# Altium project OctopusPB_r0101.PrjPcb
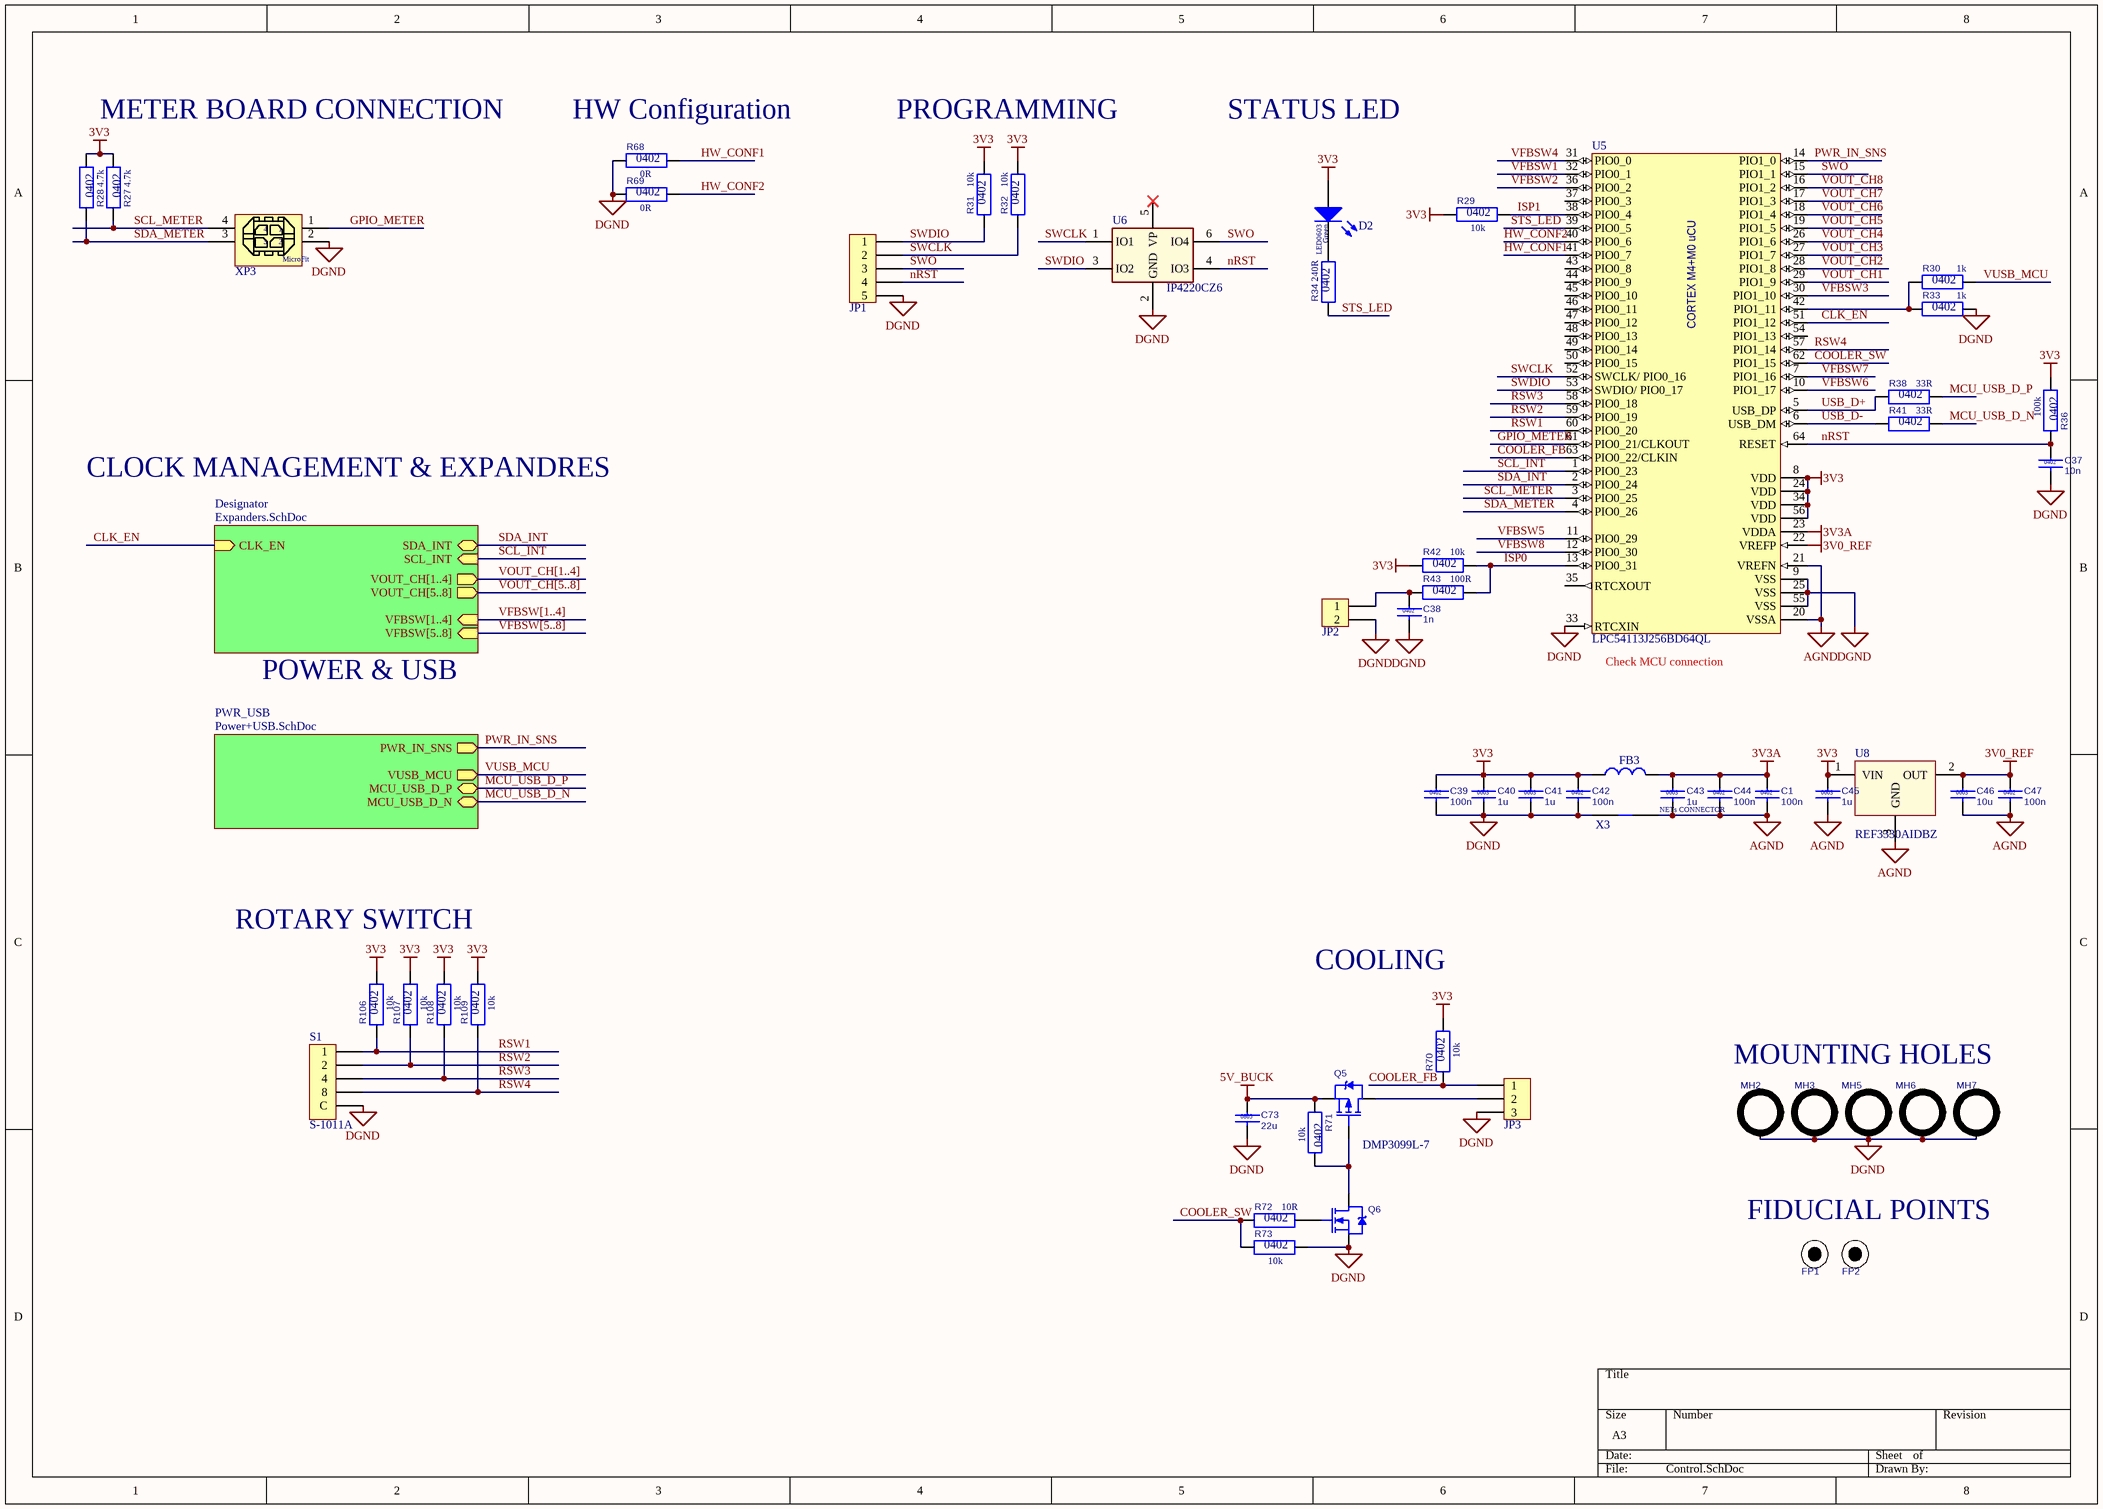
[diagram p0: Control.SchDoc]
3 sheets, 924 parts. Net scope: hierarchical (ports join the sheet entries above them; power ports are global).
Board file: OctopusPB_r0101.PcbDoc
Sheets:
  Control.SchDoc
    Designator = Expanders.SchDoc
      B1 = BuckConverter.SchDoc
      B2 = BuckConverter.SchDoc
      B3 = BuckConverter.SchDoc
      B4 = BuckConverter.SchDoc
      B5 = BuckConverter.SchDoc
      B6 = BuckConverter.SchDoc
      B7 = BuckConverter.SchDoc
      B8 = BuckConverter.SchDoc

## Sheet Control.SchDoc
size A3

### Parts
C1  100n  Case: 0402  [CC0402M]
C37  10n  Case: 0402  [CC0402M]
C38  1n  Case: 0402  [CC0402M]
C39  100n  Case: 0402  [CC0402M]
C40  1u  Case: 0603  [CC0603M]
C41  1u  Case: 0603  [CC0603M]
C42  100n  Case: 0402  [CC0402M]
C43  1u  Case: 0603  [CC0603M]
C44  100n  Case: 0402  [CC0402M]
C45  1u  Case: 0603  [CC0603M]
C46  10u  Case: 0603  [CC0603M]
C47  100n  Case: 0402  [CC0402M]
C73  22u  Case: 0805  [CC0805M]
D2  Color: Green  [LED0603]  (hidden comment: 150060GS75000)
FB3  BLM18HG102SN1D  [FB0603M]  (value not drawn)
FP1  FP  [FP]  (value not drawn)  (no BOM)
FP2  FP  [FP]  (value not drawn)  (no BOM)
JP1  HEADER-2.54-THR-1x5-MV  [HEADER-2.54-THR-1x5-MV]  (value not drawn)
JP2  HEADER-2.54-THR-1x2-MV  [HEADER-2.54-THR-1x2-MV]  (value not drawn)
JP3  HEADER-2.54-THR-1x3-MV  [HEADER-2.54-THR-1x3-MV]  (value not drawn)
MH2  MH-3.5-PLATED  [MH_3.5_PLATED]  (value not drawn)  (no BOM)
MH3  MH-3.5-PLATED  [MH_3.5_PLATED]  (value not drawn)  (no BOM)
MH5  MH-3.5-PLATED  [MH_3.5_PLATED]  (value not drawn)  (no BOM)
MH6  MH-3.5-PLATED  [MH_3.5_PLATED]  (value not drawn)  (no BOM)
MH7  MH-3.5-PLATED  [MH_3.5_PLATED]  (value not drawn)  (no BOM)
Q5  DMP3099L-7  [SOT23-3]
Q6  NX3020NAKW,115  [SOT323]  (value not drawn)
R27  Case: 0402  [RC0402M]  (hidden comment: 4.7k)
R28  Case: 0402  [RC0402M]  (hidden comment: 4.7k)
R29  Case: 0402  [RC0402M]  (hidden comment: 10k)
R30  Case: 0402  [RC0402M]  (hidden comment: 1k)
R31  Case: 0402  [RC0402M]  (hidden comment: 10k)
R32  Case: 0402  [RC0402M]  (hidden comment: 10k)
R33  Case: 0402  [RC0402M]  (hidden comment: 1k)
R34  Case: 0402  [RC0402M]  (hidden comment: 240R)
R36  Case: 0402  [RC0402M]  (hidden comment: 100k)
R38  Case: 0402  [RC0402M]  (hidden comment: 33R)
R41  Case: 0402  [RC0402M]  (hidden comment: 33R)
R42  Case: 0402  [RC0402M]  (hidden comment: 10k)
R43  Case: 0402  [RC0402M]  (hidden comment: 100R)
R68  Case: 0402  [RC0402M]  (hidden comment: 0R)
R69  Case: 0402  [RC0402M]  (hidden comment: 0R)
R70  Case: 0402  [RC0402M]  (hidden comment: 10k)
R71  Case: 0402  [RC0402M]  (hidden comment: 10k)
R72  Case: 0402  [RC0402M]  (hidden comment: 10R)
R73  Case: 0402  [RC0402M]  (hidden comment: 10k)
R106  Case: 0402  [RC0402M]  (hidden comment: 10k)
R107  Case: 0402  [RC0402M]  (hidden comment: 10k)
R108  Case: 0402  [RC0402M]  (hidden comment: 10k)
R109  Case: 0402  [RC0402M]  (hidden comment: 10k)
S1  S-1011A  [S-1011A]
U5  LPC54113J256BD64QL  [LQFP-64]
U6  IP4220CZ6  [TSOP-6]
U8  REF3330AIDBZ  [SOT23-3]
X3  NETs_CONNECTOR  [NETs_CONNECTOR]  (value not drawn)  (no BOM)
XP3  0447690401  [0447690401]  (value not drawn)

### Sub-sheets
Designator = Expanders.SchDoc: SDA_INT (bidir), SCL_INT (in), VOUT_CH[5..8] (out), CLK_EN (in), VFBSW[1..4] (in), VOUT_CH[1..4] (out), VFBSW[5..8] (in)
PWR_USB = Power+USB.SchDoc (file not in this document): PWR_IN_SNS (out), MCU_USB_D_N (bidir), MCU_USB_D_P (bidir), VUSB_MCU (out)

### Nets
3V0_REF: C46.1 C47.1 U5.22(VREFP) U8.2(OUT)
3V3: C39.1 C40.1 C41.1 C42.1 C45.1 D2.2(A) FB3.1 R27.2 R28.2 R29.1 R31.2 R32.2 R36.2 R42.1 R70.2 R106.2 R107.2 R108.2 R109.2 U5.8(VDD) U5.24(VDD) U5.34(VDD) U5.56(VDD) U8.1(VIN)
3V3A: C1.1 C43.1 C44.1 FB3.2 U5.23(VDDA)
5V_BUCK: C73.1 Q5.2(S) R71.1
AGND: C1.2 C43.2 C44.2 C45.2 C46.2 C47.2 U5.20(VSSA) U5.21(VREFN) U8.3(GND) X3.1
DGND: C37.2 C38.2 C39.2 C40.2 C41.2 C42.2 C73.2 JP1.5 JP2.2 JP3.3 MH2.0 MH3.0 MH5.0 MH6.0 MH7.0 Q6.2(S) R33.2 R68.1 R69.1 R73.2 S1.C U5.9(VSS) U5.25(VSS) U5.33(RTCXIN) U5.55(VSS) U6.2(GND) X3.2 XP3.2
CLK_EN: U5.51(PIO1_12) ; sheet Designator/CLK_EN
COOLER_FB: JP3.1 R70.1 U5.63(PIO0_22/CLKIN)
COOLER_SW: R72.1 R73.1 U5.62(PIO1_15)
GPIO_METER: U5.61(PIO0_21/CLKOUT) XP3.1
HW_CONF1: R68.2 U5.41(PIO0_7)
HW_CONF2: R69.2 U5.40(PIO0_6)
ISP0: R42.2 R43.2 U5.13(PIO0_31)
ISP1: R29.2 U5.38(PIO0_4)
MCU_USB_D_N: R41.2 ; sheet PWR_USB/MCU_USB_D_N
MCU_USB_D_P: R38.2 ; sheet PWR_USB/MCU_USB_D_P
nRST: C37.1 JP1.4 R36.1 U5.64(RESET) U6.4(IO3)
PWR_IN_SNS: U5.14(PIO1_0) ; sheet PWR_USB/PWR_IN_SNS
RSW1: R106.1 S1.1 U5.60(PIO0_20)
RSW2: R107.1 S1.2 U5.59(PIO0_19)
RSW3: R108.1 S1.4 U5.58(PIO0_18)
RSW4: R109.1 S1.8 U5.57(PIO1_14)
SCL_INT: U5.1(PIO0_23) ; sheet Designator/SCL_INT
SCL_METER: R27.1 U5.3(PIO0_25) XP3.4
SDA_INT: U5.2(PIO0_24) ; sheet Designator/SDA_INT
SDA_METER: R28.1 U5.4(PIO0_26) XP3.3
STS_LED: R34.1 U5.39(PIO0_5)
SWCLK: JP1.2 R32.1 U5.52(SWCLK/_PIO0_16) U6.1(IO1)
SWDIO: JP1.1 R31.1 U5.53(SWDIO/_PIO0_17) U6.3(IO2)
SWO: JP1.3 U5.15(PIO1_1) U6.6(IO4)
USB_D+: R38.1 U5.5(USB_DP)
USB_D-: R41.1 U5.6(USB_DM)
VFBSW1: U5.32(PIO0_1)
VFBSW2: U5.36(PIO0_2)
VFBSW3: U5.30(PIO1_10)
VFBSW4: U5.31(PIO0_0)
VFBSW5: U5.11(PIO0_29)
VFBSW6: U5.10(PIO1_17)
VFBSW7: U5.7(PIO1_16)
VFBSW8: U5.12(PIO0_30)
VOUT_CH1: U5.29(PIO1_9)
VOUT_CH2: U5.28(PIO1_8)
VOUT_CH3: U5.27(PIO1_7)
VOUT_CH4: U5.26(PIO1_6)
VOUT_CH5: U5.19(PIO1_5)
VOUT_CH6: U5.18(PIO1_4)
VOUT_CH7: U5.17(PIO1_3)
VOUT_CH8: U5.16(PIO1_2)
VUSB_MCU: R30.2 ; sheet PWR_USB/VUSB_MCU
NetC38_1: C38.1 JP2.1 R43.1
NetD2_1: D2.1(K) R34.2
NetJP3_2: JP3.2 Q5.3(D)
NetQ5_1: Q5.1(G) Q6.3(D) R71.2
NetQ6_1: Q6.1(G) R72.2
NetR30_1: R30.1 R33.1 U5.42(PIO1_11)

Not connected (* = marked no-connect by the designer): U5 35(RTCXOUT) 37(PIO0_3) 43(PIO0_8) 44(PIO0_9) 45(PIO0_10) 46(PIO0_11) 47(PIO0_12) 48(PIO0_13) 49(PIO0_14) 50(PIO0_15) 54(PIO1_13); U6 5(VP)*

### Buses and harness runs
bus VFBSW[1..4] = sheet Designator/VFBSW[1..4]
bus VFBSW[5..8] = sheet Designator/VFBSW[5..8]
bus VOUT_CH[1..4] = sheet Designator/VOUT_CH[1..4]
bus VOUT_CH[5..8] = sheet Designator/VOUT_CH[5..8]

### Notes on the sheet
- METER BOARD CONNECTION
- (near R68) HW Configuration
- PROGRAMMING
- STATUS LED
- CLOCK MANAGEMENT & EXPANDRES
- POWER & USB
- (near U5) Check MCU connection
- ROTARY SWITCH
- COOLING
- MOUNTING HOLES
- FIDUCIAL POINTS
- (in symbol 0447690401) MicroFit
- (in symbol LPC54113J256BD64QL) CORTEX M4+M0 uCU
- (in symbol NETs_CONNECTOR) NETs CONNECTOR

### Library data of the parts
C1 C39 C42 C44 C47 = CC0402K-X7R-25V-100N-M: Chip ceramic capacitor; Manufacturer PN: GRM155R71E104KE14J; Manufacturer: Murata; Tollerance: 10%; Rated Voltage: 25V; Material: X7R; PartNumber: CC0402K-X7R-25V-100N-M; Value: 100n; Publisher: alexey.savchenko; Publishing Date: 1/12/2020
C37 = CC0402K-X7R-50V-10N-M: Chip ceramic capacitor; Manufacturer PN: CC0402KRX7R9BB103; Manufacturer: Yageo; Tollerance: 10%; Rated Voltage: 50V; Material: X7R; PartNumber: CC0402K-X7R-50V-10N-M; Value: 10n; Publisher: alexey.savchenko; Publishing Date: 2/27/2020
C38 = CC0402K-X7R-50V-1N-M: Chip ceramic capacitor; Manufacturer PN: CC0402KRX7R9BB102; Manufacturer: Yageo; Tollerance: 10%; Rated Voltage: 50V; Material: X7R; PartNumber: CC0402K-X7R-50V-1N-M; Value: 1n; Publisher: alexey.savchenko; Publishing Date: 2/27/2020
C40 C41 C43 C45 = CC0603K-X7R-10V-1U-M: Chip ceramic capacitor; Manufacturer PN: CL10B105KP8NNNC; Manufacturer: Samsung; Tollerance: 10%; Rated Voltage: 10V; Material: X5R; PartNumber: CC0603K-X7R-10V-1U-M; Value: 1u; Publisher: alexey.savchenko; Publishing Date: 1/12/2020
C46 = CC0603K-X5R-10V-10U-M: Chip ceramic capacitor; Manufacturer PN: GRM188R61A106KE69D; Manufacturer: Murata; Tollerance: 10%; Rated Voltage: 10V; Material: X5R; PartNumber: CC0603K-X5R-10V-10U-M; Value: 10u; Publisher: alexey.savchenko; Publishing Date: 1/12/2020
C73 = CC0805K-X5R-10V-22U-M: Chip ceramic capacitor; Manufacturer PN: CL21A226KPCLRNC; Manufacturer: Samsung; Tollerance: 10%; Rated Voltage: 10V; Material: X5R; PartNumber: CC0805K-X5R-10V-22U-M; Value: 22u; Publisher: alexey.savchenko; Publishing Date: 2/17/2020
D2 = 150060GS75000: LED GREEN CLEAR 0603 SMD; Manufacturer: Würth Elektronik; Case: LED0603; PartNumber: 150060GS75000; Manufacturer PN: 150060GS75000; Publisher: alexey.savchenko; Publishing Date: 1/27/2020
FB3 = BLM18HG102SN1D: FERRITE BEAD 1 KOHM 0603 1LN; Manufacturer: Murata; Resistance: 1000; PartNumber: BLM18HG102SN1D; Manufacturer PN: BLM18HG102SN1D; Publisher: alexey.savchenko; Publishing Date: 1/12/2020
FP1 FP2 = FP: No BOM component to short circuit 2 nets; Manufacturer PN: NULL; PartNumber: FP; Manufacturer: NULL; Publisher: alexey.savchenko; Publishing Date: 2/14/2020
JP1 = HEADER-2.54-THR-1x5-MV: Header Connector, 2.54mm pitch, Single, 5 contacts, Male, Vertical; Manufacturer PN: PH1-05-UA; Manufacturer: Adam Tech; PartNumber: HEADER-2.54-THR-1x5-MV; Publisher: alexey.savchenko; Publishing Date: 1/24/2020
JP2 = HEADER-2.54-THR-1x2-MV: Header Connector, 2.54mm pitch, Single, 2 contacts, Male, Vertical; Manufacturer PN: PH1-02-UA; Manufacturer: Adam Tech; PartNumber: HEADER-2.54-THR-1x2-MV; Publisher: alexey.savchenko; Publishing Date: 1/24/2020
JP3 = HEADER-2.54-THR-1x3-MV: Header Connector, 2.54mm pitch, Single, 3 contacts, Male, Vertical; Manufacturer PN: PH1-03-UA; Manufacturer: Adam Tech; PartNumber: HEADER-2.54-THR-1x3-MV; Publisher: alexey.savchenko; Publishing Date: 1/24/2020
MH2 MH3 MH5-MH7 = MH-3.5-PLATED: Mounting Hole; Manufacturer PN: NULL; PartNumber: MH-3.5-PLATED; Manufacturer: NULL; Publisher: alexey.savchenko; Publishing Date: 3/25/2020
Q5 = DMP3099L-7: P-Channel 30V 3.8A (Ta) 1.08W (Ta) Surface Mount SOT-23; Manufacturer: Diodes; PartNumber: DMP3099L-7; Manufacturer PN: DMP3099L-7; Case: SOT23-3; Publisher: alexey.savchenko; Publishing Date: 2/26/2020
Q6 = NX3020NAKW,115: MOSFET N-CH 30V 180MA SOT323; Manufacturer: Nexperia; Analogs: DMN63D8LW-7; PartNumber: NX3020NAKW,115; Manufacturer PN: NX3020NAKW,115; Case: SOT323; Publisher: alexey.savchenko; Publishing Date: 2/17/2020
R27 R28 = RC0402F-4K7-M: Chip resistor; Manufacturer PN: RC0402FR-074K7L; Manufacturer: Yageo; Tollerance: 1%; Rated Voltage: 50V; Power: 0.063W; T Coefficient: 100ppm; Value: 4.7k; PartNumber: RC0402F-4K7-M; Publisher: alexey.savchenko; Publishing Date: 2/24/2020
R29 R31 R32 R42 R70 R71 R73 R106-R109 = RC0402F-10K-M: Chip resistor; Manufacturer PN: RC0402FR-0710KL; Manufacturer: Yageo; Tollerance: 1%; Rated Voltage: 50V; Power: 0.063W; T Coefficient: 100ppm; Value: 10k; PartNumber: RC0402F-10K-M; Publisher: alexey.savchenko; Publishing Date: 2/24/2020
R30 R33 = RC0402F-1K-M: Chip resistor; Manufacturer PN: RC0402FR-071KL; Manufacturer: Yageo; Tollerance: 1%; Rated Voltage: 50V; Power: 0.063W; T Coefficient: 100ppm; Value: 1k; PartNumber: RC0402F-1K-M; Publisher: alexey.savchenko; Publishing Date: 2/24/2020
R34 = RC0402F-240R-M: Chip resistor; Manufacturer PN: RC0402FR-07240RL; Manufacturer: Yageo; Tollerance: 1%; Rated Voltage: 50V; Power: 0.063W; Value: 240R; PartNumber: RC0402F-240R-M; Publisher: alexey.savchenko; Publishing Date: 2/24/2020
R36 = RC0402F-100K-M: Chip resistor; Manufacturer PN: RC0402FR-07100KL; Manufacturer: Yageo; Tollerance: 1%; Rated Voltage: 50V; Power: 0.063W; T Coefficient: 100ppm; Value: 100k; PartNumber: RC0402F-100K-M; Publisher: alexey.savchenko; Publishing Date: 2/24/2020
R38 R41 = RC0402F-33R-M: Chip resistor; Manufacturer PN: RC0402FR-0733RL; Manufacturer: Yageo; Tollerance: 1%; Rated Voltage: 50V; Power: 0.063W; Value: 33R; PartNumber: RC0402F-33R-M; Publisher: alexey.savchenko; Publishing Date: 2/24/2020
R43 = RC0402F-100R-M: Chip resistor; Manufacturer PN: RC0402FR-07100RL; Manufacturer: Yageo; Tollerance: 1%; Rated Voltage: 50V; Power: 0.063W; Value: 100R; PartNumber: RC0402F-100R-M; Publisher: alexey.savchenko; Publishing Date: 2/24/2020
R68 R69 = RC0402F-0R-M: Chip resistor; Manufacturer PN: RC0402FR-070RL; Manufacturer: Yageo; Tollerance: 1%; Rated Voltage: 50V; Power: 0.063W; Value: 0R; PartNumber: RC0402F-0R-M; Publisher: alexey.savchenko; Publishing Date: 2/24/2020
R72 = RC0402F-10R-M: Chip resistor; Manufacturer PN: RC0402FR-0710RL; Manufacturer: Yageo; Tollerance: 1%; Rated Voltage: 50V; Power: 0.063W; Value: 10R; PartNumber: RC0402F-10R-M; Publisher: alexey.savchenko; Publishing Date: 2/24/2020
S1 = S-1011A: Dip Switch Hexadecimal 16 Position Through Hole, Right Angle Rotary for Tool Actuator 100mA 5VDC; Manufacturer PN: DSC6001CI2A-004.0000S-1011A; Manufacturer: Nidec Copal Electronics; PartNumber: S-1011A; Publisher: alexey.savchenko; Publishing Date: 4/17/2020
U5 = LPC54113J256BD64QL: IC MCU 32BIT 256KB FLASH 64LQFP; Manufacturer: NXP; PartNumber: LPC54113J256BD64QL; Manufacturer PN: LPC54113J256BD64QL; Case: LQFP-64; Publisher: alexey.savchenko; Publishing Date: 1/24/2020
U6 = IP4220CZ6: TVS DIODE 5.5V 6TSOP; Manufacturer: Nexperia; PartNumber: IP4220CZ6; Manufacturer PN: IP4220CZ6; Case: TSOP-6; Publisher: alexey.savchenko; Publishing Date: 1/24/2020
U8 = REF3330AIDBZ: IC VREF SERIES 0.15% SOT23-3; Manufacturer: TI; PartNumber: REF3330AIDBZ; Manufacturer PN: REF3330AIDBZ; Case: SOT23-3; Publisher: alexey.savchenko; Publishing Date: 2/19/2020
X3 = NETs_CONNECTOR: No BOM component to short circuit 2 nets; Manufacturer PN: NULL; PartNumber: NETs_CONNECTOR; Manufacturer: NULL; Publisher: alexey.savchenko; Publishing Date: 2/14/2020
XP3 = 0447690401: Micro-Fit BMI Receptacle Header, Dual Row, Vertical, with Press-fit Plastic Pegs, 2.54µm Tin (Sn), 4 Circuits; Manufacturer: Molex; Analogs: 0447690402, 0447690403; PartNumber: 0447690401; Manufacturer PN: 0447690401; Publisher: alexey.savchenko; Publishing Date: 2/14/2020

## Sheet Expanders.SchDoc
size A2
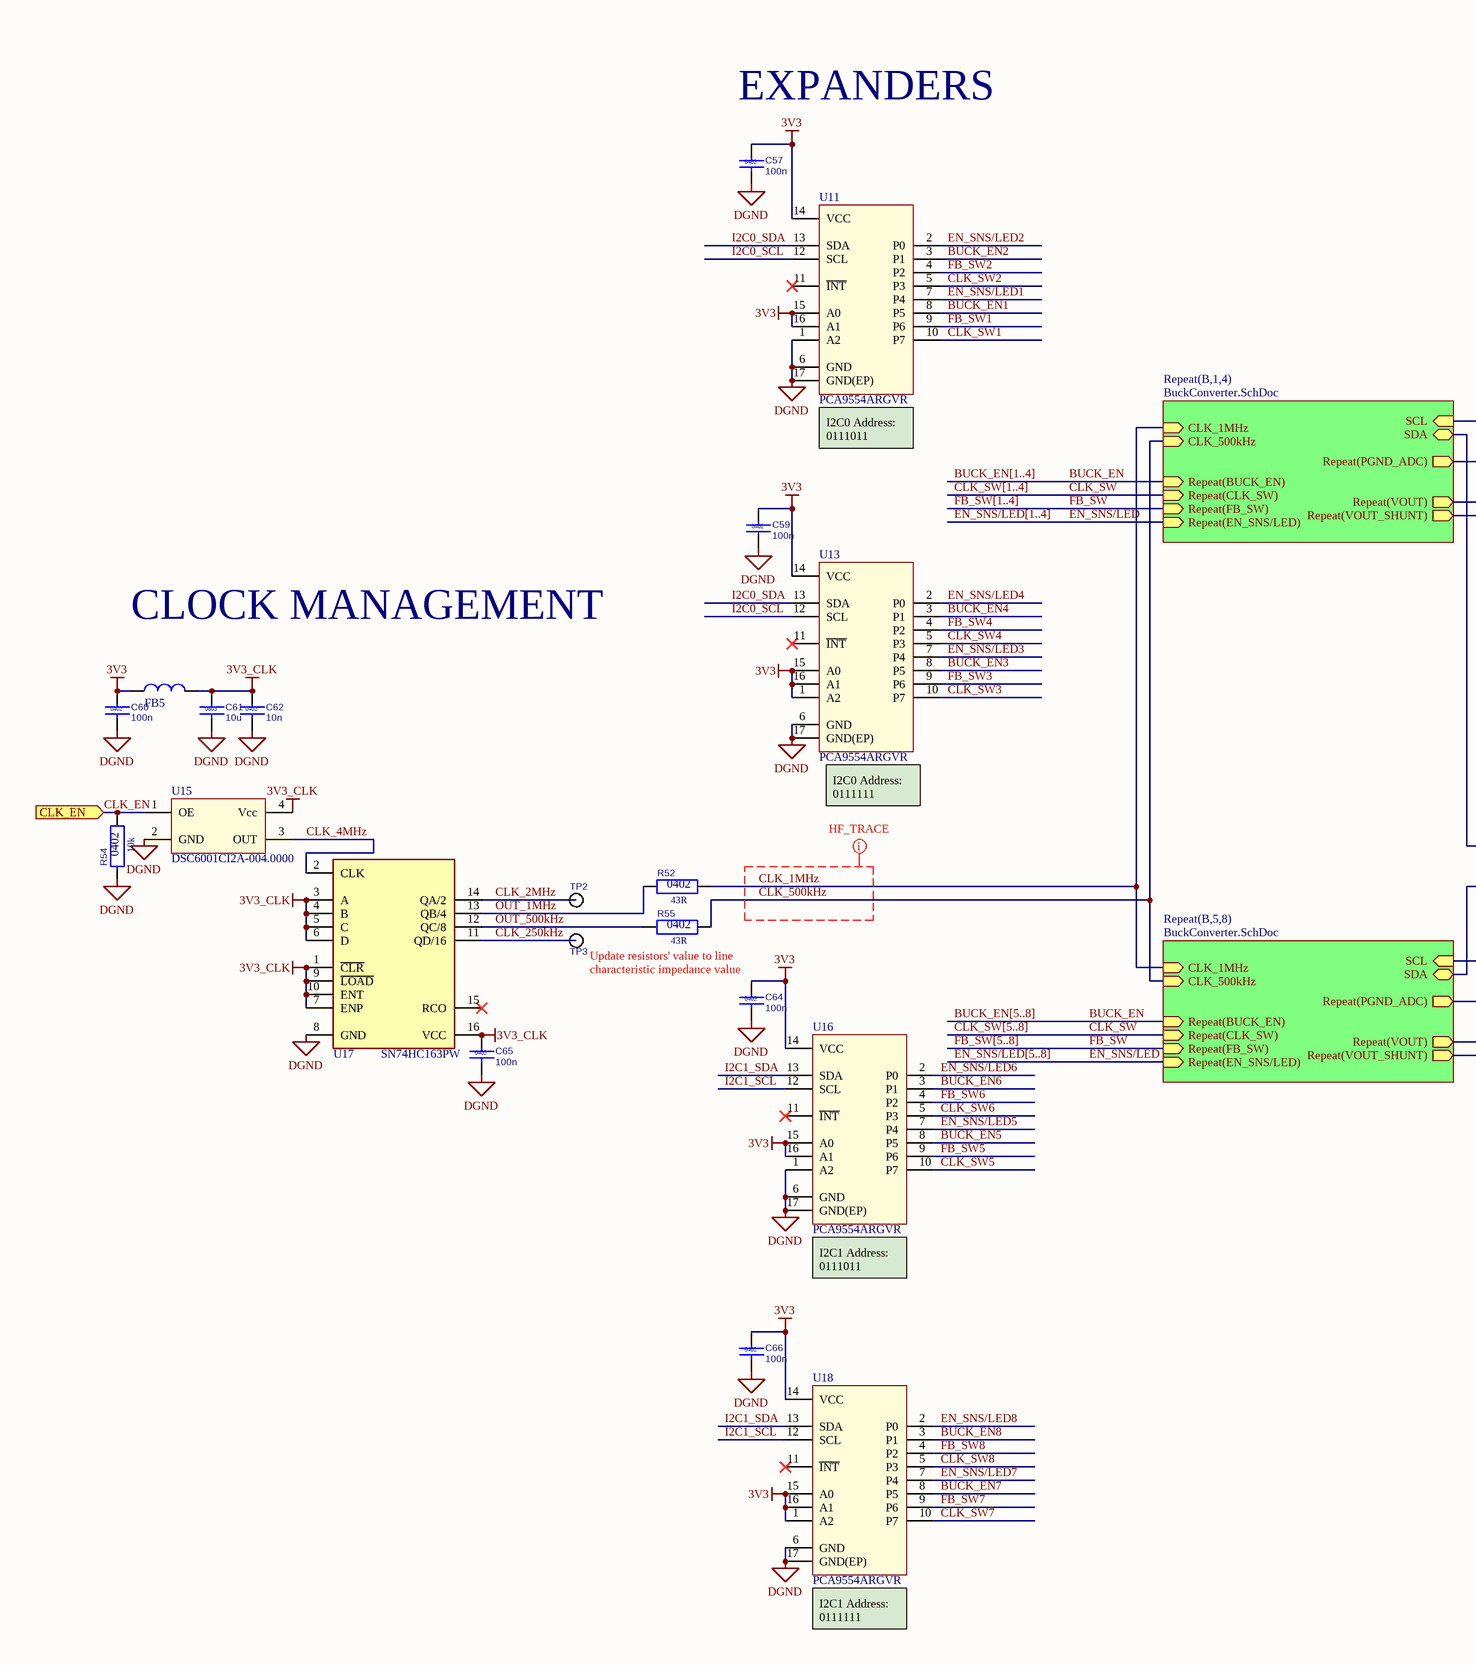
[diagram p1: Expanders.SchDoc, left]
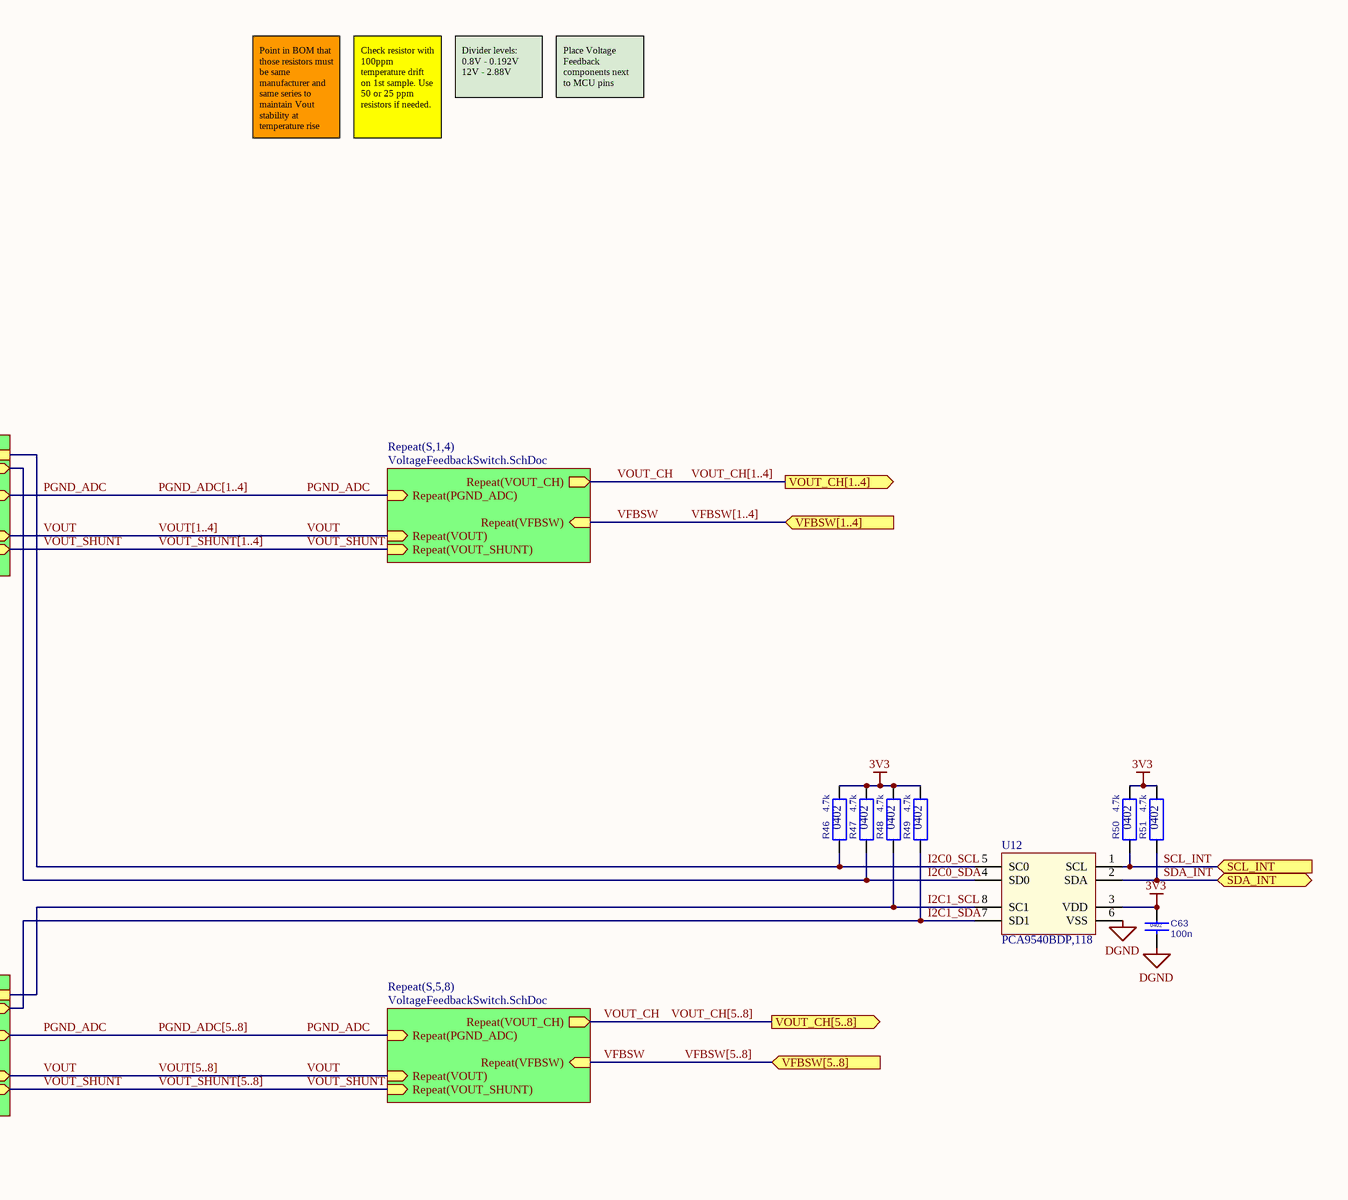
[diagram p2: Expanders.SchDoc, right]

### Parts
C57  100n  Case: 0402  [CC0402M]
C59  100n  Case: 0402  [CC0402M]
C60  100n  Case: 0402  [CC0402M]
C61  10u  Case: 0805  [CC0805M]
C62  10n  Case: 0402  [CC0402M]
C63  100n  Case: 0402  [CC0402M]
C64  100n  Case: 0402  [CC0402M]
C65  100n  Case: 0402  [CC0402M]
C66  100n  Case: 0402  [CC0402M]
FB5  BLM18HG102SN1D  [FB0603M]  (value not drawn)
R46  Case: 0402  [RC0402M]  (hidden comment: 4.7k)
R47  Case: 0402  [RC0402M]  (hidden comment: 4.7k)
R48  Case: 0402  [RC0402M]  (hidden comment: 4.7k)
R49  Case: 0402  [RC0402M]  (hidden comment: 4.7k)
R50  Case: 0402  [RC0402M]  (hidden comment: 4.7k)
R51  Case: 0402  [RC0402M]  (hidden comment: 4.7k)
R52  Case: 0402  [RC0402M]  (hidden comment: 43R)
R54  Case: 0402  [RC0402M]  (hidden comment: 10k)
R55  Case: 0402  [RC0402M]  (hidden comment: 43R)
TP2  TEST_POINT  [TEST_POINT_SMALL]  (value not drawn)  (no BOM)
TP3  TEST_POINT  [TEST_POINT_SMALL]  (value not drawn)  (no BOM)
U11  PCA9554ARGVR  [VQFN-16(RGV)]
U12  PCA9540BDP,118  [TSSOP-8]
U13  PCA9554ARGVR  [VQFN-16(RGV)]
U15  DSC6001CI2A-004.0000  [CDFN3225-4LD]
U16  PCA9554ARGVR  [VQFN-16(RGV)]
U17  SN74HC163PW  [TSSOP-16]
U18  PCA9554ARGVR  [VQFN-16(RGV)]

### Sub-sheets
Repeat(B,1,4) = BuckConverter.SchDoc: CLK_1MHz (in), SDA (bidir), SCL (in), CLK_500kHz (in), Repeat(VOUT) (out), Repeat(FB_SW) (in), Repeat(CLK_SW) (in), Repeat(BUCK_EN) (in), Repeat(EN_SNS/LED) (in), Repeat(PGND_ADC) (out), Repeat(VOUT_SHUNT) (out)
Repeat(B,5,8) = BuckConverter.SchDoc: CLK_1MHz (in), SDA (bidir), SCL (in), CLK_500kHz (in), Repeat(FB_SW) (in), Repeat(CLK_SW) (in), Repeat(BUCK_EN) (in), Repeat(EN_SNS/LED) (in), Repeat(VOUT) (out), Repeat(PGND_ADC) (out), Repeat(VOUT_SHUNT) (out)
Repeat(S,1,4) = VoltageFeedbackSwitch.SchDoc (file not in this document): Repeat(VFBSW) (in), Repeat(VOUT_CH) (out), Repeat(VOUT_SHUNT) (in), Repeat(VOUT) (in), Repeat(PGND_ADC) (in)
Repeat(S,5,8) = VoltageFeedbackSwitch.SchDoc (file not in this document): Repeat(VFBSW) (in), Repeat(VOUT_CH) (out), Repeat(VOUT_SHUNT) (in), Repeat(VOUT) (in), Repeat(PGND_ADC) (in)

### Ports
CLK_EN (in), SCL_INT (in), SDA_INT (bidir), VFBSW[1..4] (in), VFBSW[5..8] (in), VOUT_CH[1..4] (out), VOUT_CH[5..8] (out)

### Nets
3V3: C57.1 C59.1 C60.1 C63.1 C64.1 C66.1 FB5.1 R46.2 R47.2 R48.2 R49.2 R50.2 R51.2 U11.14(VCC) U11.15(A0) U11.16(A1) U12.3(VDD) U13.1(A2) U13.14(VCC) U13.15(A0) U13.16(A1) U16.14(VCC) U16.15(A0) U16.16(A1) U18.1(A2) U18.14(VCC) U18.15(A0) U18.16(A1)
3V3_CLK: C61.1 C62.1 C65.1 FB5.2 U15.4(Vcc) U17.1(~{CLR}) U17.3(A) U17.4(B) U17.5(C) U17.6(D) U17.7(ENP) U17.9(~{LOAD}) U17.10(ENT) U17.16(VCC)
DGND: C57.2 C59.2 C60.2 C61.2 C62.2 C63.2 C64.2 C65.2 C66.2 R54.1 U11.1(A2) U11.6(GND) U11.17(GND(EP)) U12.6(VSS) U13.6(GND) U13.17(GND(EP)) U15.2(GND) U16.1(A2) U16.6(GND) U16.17(GND(EP)) U17.8(GND) U18.6(GND) U18.17(GND(EP))
BUCK_EN: sheet Repeat(B,1,4)/Repeat(BUCK_EN), sheet Repeat(B,5,8)/Repeat(BUCK_EN)
BUCK_EN1: U11.8(P5)
BUCK_EN2: U11.3(P1)
BUCK_EN3: U13.8(P5)
BUCK_EN4: U13.3(P1)
BUCK_EN5: U16.8(P5)
BUCK_EN6: U16.3(P1)
BUCK_EN7: U18.8(P5)
BUCK_EN8: U18.3(P1)
CLK_1MHz: R52.2 ; sheet Repeat(B,1,4)/CLK_1MHz, sheet Repeat(B,5,8)/CLK_1MHz
CLK_2MHz: TP2.0 U17.14(QA/2)
CLK_4MHz: U15.3(OUT) U17.2(CLK)
CLK_250kHz: TP3.0 U17.11(QD/16)
CLK_500kHz: R55.2 ; sheet Repeat(B,1,4)/CLK_500kHz, sheet Repeat(B,5,8)/CLK_500kHz
CLK_EN: R54.2 U15.1(OE) ; port CLK_EN
CLK_SW: sheet Repeat(B,1,4)/Repeat(CLK_SW), sheet Repeat(B,5,8)/Repeat(CLK_SW)
CLK_SW1: U11.10(P7)
CLK_SW2: U11.5(P3)
CLK_SW3: U13.10(P7)
CLK_SW4: U13.5(P3)
CLK_SW5: U16.10(P7)
CLK_SW6: U16.5(P3)
CLK_SW7: U18.10(P7)
CLK_SW8: U18.5(P3)
EN_SNS/LED: sheet Repeat(B,1,4)/Repeat(EN_SNS/LED), sheet Repeat(B,5,8)/Repeat(EN_SNS/LED)
EN_SNS/LED1: U11.7(P4)
EN_SNS/LED2: U11.2(P0)
EN_SNS/LED3: U13.7(P4)
EN_SNS/LED4: U13.2(P0)
EN_SNS/LED5: U16.7(P4)
EN_SNS/LED6: U16.2(P0)
EN_SNS/LED7: U18.7(P4)
EN_SNS/LED8: U18.2(P0)
FB_SW: sheet Repeat(B,1,4)/Repeat(FB_SW), sheet Repeat(B,5,8)/Repeat(FB_SW)
FB_SW1: U11.9(P6)
FB_SW2: U11.4(P2)
FB_SW3: U13.9(P6)
FB_SW4: U13.4(P2)
FB_SW5: U16.9(P6)
FB_SW6: U16.4(P2)
FB_SW7: U18.9(P6)
FB_SW8: U18.4(P2)
I2C0_SCL: R46.1 U11.12(SCL) U12.5(SC0) U13.12(SCL) ; sheet Repeat(B,1,4)/SCL
I2C0_SDA: R47.1 U11.13(SDA) U12.4(SD0) U13.13(SDA) ; sheet Repeat(B,1,4)/SDA
I2C1_SCL: R48.1 U12.8(SC1) U16.12(SCL) U18.12(SCL) ; sheet Repeat(B,5,8)/SCL
I2C1_SDA: R49.1 U12.7(SD1) U16.13(SDA) U18.13(SDA) ; sheet Repeat(B,5,8)/SDA
OUT_1MHz: R52.1 U17.13(QB/4)
OUT_500kHz: R55.1 U17.12(QC/8)
PGND_ADC: sheet Repeat(B,1,4)/Repeat(PGND_ADC), sheet Repeat(S,1,4)/Repeat(PGND_ADC), sheet Repeat(B,5,8)/Repeat(PGND_ADC), sheet Repeat(S,5,8)/Repeat(PGND_ADC)
SCL_INT: R50.1 U12.1(SCL) ; port SCL_INT
SDA_INT: R51.1 U12.2(SDA) ; port SDA_INT
VFBSW: sheet Repeat(S,1,4)/Repeat(VFBSW), sheet Repeat(S,5,8)/Repeat(VFBSW)
VOUT: sheet Repeat(B,1,4)/Repeat(VOUT), sheet Repeat(S,1,4)/Repeat(VOUT), sheet Repeat(B,5,8)/Repeat(VOUT), sheet Repeat(S,5,8)/Repeat(VOUT)
VOUT_CH: sheet Repeat(S,1,4)/Repeat(VOUT_CH), sheet Repeat(S,5,8)/Repeat(VOUT_CH)
VOUT_SHUNT: sheet Repeat(B,1,4)/Repeat(VOUT_SHUNT), sheet Repeat(S,1,4)/Repeat(VOUT_SHUNT), sheet Repeat(B,5,8)/Repeat(VOUT_SHUNT), sheet Repeat(S,5,8)/Repeat(VOUT_SHUNT)

Not connected (* = marked no-connect by the designer): U11 11(~{INT})*; U13 11(~{INT})*; U16 11(~{INT})*; U17 15(RCO)*; U18 11(~{INT})*

### Buses and harness runs
bus BUCK_EN[1..4]
bus BUCK_EN[5..8]
bus CLK_SW[1..4]
bus CLK_SW[5..8]
bus EN_SNS/LED[1..4]
bus EN_SNS/LED[5..8]
bus FB_SW[1..4]
bus FB_SW[5..8]
bus PGND_ADC[1..4]
bus PGND_ADC[5..8]
bus VFBSW[1..4] = port VFBSW[1..4]
bus VFBSW[5..8] = port VFBSW[5..8]
bus VOUT[1..4]
bus VOUT[5..8]
bus VOUT_CH[1..4] = port VOUT_CH[1..4]
bus VOUT_CH[5..8] = port VOUT_CH[5..8]
bus VOUT_SHUNT[1..4]
bus VOUT_SHUNT[5..8]

### Layout directives
net class HF_TRACE: CLK_1MHz, CLK_500kHz

### Notes on the sheet
- Divider levels:
  0.8V - 0.192V
  12V - 2.88V
- Place Voltage Feedback components next to MCU pins
- (near C57) EXPANDERS
- Point in BOM that those resistors must be same manufacturer and same series to maintain Vout stability at temperature rise
- Check resistor with 100ppm temperature drift on 1st sample. Use 50 or 25 ppm resistors if needed.
- (near U11) I2C0 Address:
  0111011
- CLOCK MANAGEMENT
- (near U13) I2C0 Address:
  0111111
- Update resistors' value to line characteristic impedance value
- (near U16) I2C1 Address:
  0111011
- (near U18) I2C1 Address:
  0111111

### Library data of the parts
C57 C59 C60 C63-C66 = CC0402K-X7R-25V-100N-M: as C1 on sheet Control; PartNumber: CC0402K-X7R-25V-100N-M; Value: 100n; Publisher: alexey.savchenko; Publishing Date: 1/12/2020
C61 = CC0805K-X7R-6V3-10U-M: Chip ceramic capacitor; Manufacturer PN: CL21B106KQQNNNG; Manufacturer: Samsung; Tollerance: 10%; Rated Voltage: 6.3V; Material: X7R; PartNumber: CC0805K-X7R-6V3-10U-M; Value: 10u; Publisher: alexey.savchenko; Publishing Date: 2/17/2020
C62 = CC0402K-X7R-50V-10N-M: as C37 on sheet Control; PartNumber: CC0402K-X7R-50V-10N-M; Value: 10n; Publisher: alexey.savchenko; Publishing Date: 2/27/2020
FB5 = BLM18HG102SN1D: as FB3 on sheet Control; PartNumber: BLM18HG102SN1D; Manufacturer PN: BLM18HG102SN1D; Publisher: alexey.savchenko; Publishing Date: 1/12/2020
R46-R51 = RC0402F-4K7-M: as R27 on sheet Control; Value: 4.7k; PartNumber: RC0402F-4K7-M; Publisher: alexey.savchenko; Publishing Date: 2/24/2020
R52 R55 = RC0402F-43R-M: Chip resistor; Manufacturer PN: RC0402FR-0743RL; Manufacturer: Yageo; Tollerance: 1%; Rated Voltage: 50V; Power: 0.063W; Value: 43R; PartNumber: RC0402F-43R-M; Publisher: alexey.savchenko; Publishing Date: 2/24/2020
R54 = RC0402F-10K-M: as R29 on sheet Control; Value: 10k; PartNumber: RC0402F-10K-M; Publisher: alexey.savchenko; Publishing Date: 2/24/2020
TP2 TP3 = TEST_POINT_SMALL: Test point; Manufacturer PN: NULL; PartNumber: TEST_POINT_SMALL; Manufacturer: NULL; Publisher: alexey.savchenko; Publishing Date: 2/14/2020
U11 U13 U16 U18 = PCA9554ARGVR: I/O Expander 8 I²C, SMBus 400kHz 16-VQFN (4x4); Manufacturer: TI; Analogs: NXP has same chip; PartNumber: PCA9554ARGVR; Manufacturer PN: PCA9554ARGVR; Case: VQFN-16(RGV); Publisher: alexey.savchenko; Publishing Date: 2/26/2020
U12 = PCA9540BDP,118: IC INTERFACE SPECIALIZED 8TSSOP; Manufacturer: NXP; PartNumber: PCA9540BDP,118; Manufacturer PN: PCA9540BDP,118; Case: TSSOP-8; Publisher: alexey.savchenko; Publishing Date: 1/24/2020
U15 = DSC6001CI2A-004.0000: 4MHz XO (Standard) CMOS Oscillator 1.8V ~ 3.3V Enable/Disable 4-SMD, No Lead; Manufacturer: Microchip; PartNumber: DSC6001CI2A-004.0000; Manufacturer PN: DSC6001CI2A-004.0000; Frequency: 4MHz; Publisher: alexey.savchenko; Publishing Date: 3/6/2020
U17 = SN74HC163PW: Counter IC Binary Counter 1 Element 4 Bit Positive Edge 16-TSSOP; Manufacturer: TI; PartNumber: SN74HC163PW; Manufacturer PN: SN74HC163PW; Case: TSSOP-16; Publisher: alexey.savchenko; Publishing Date: 3/6/2020

## Sheet BuckConverter.SchDoc
size A2; DrawnBy: Alexey Savchenko; Organization: Ring; Revision: 1.0
Used 8 times, as channels Designator/B1, Designator/B2, Designator/B3, Designator/B4, Designator/B5, Designator/B6, Designator/B7, Designator/B8. Parts and nets are listed once, with the designators drawn on the sheet.
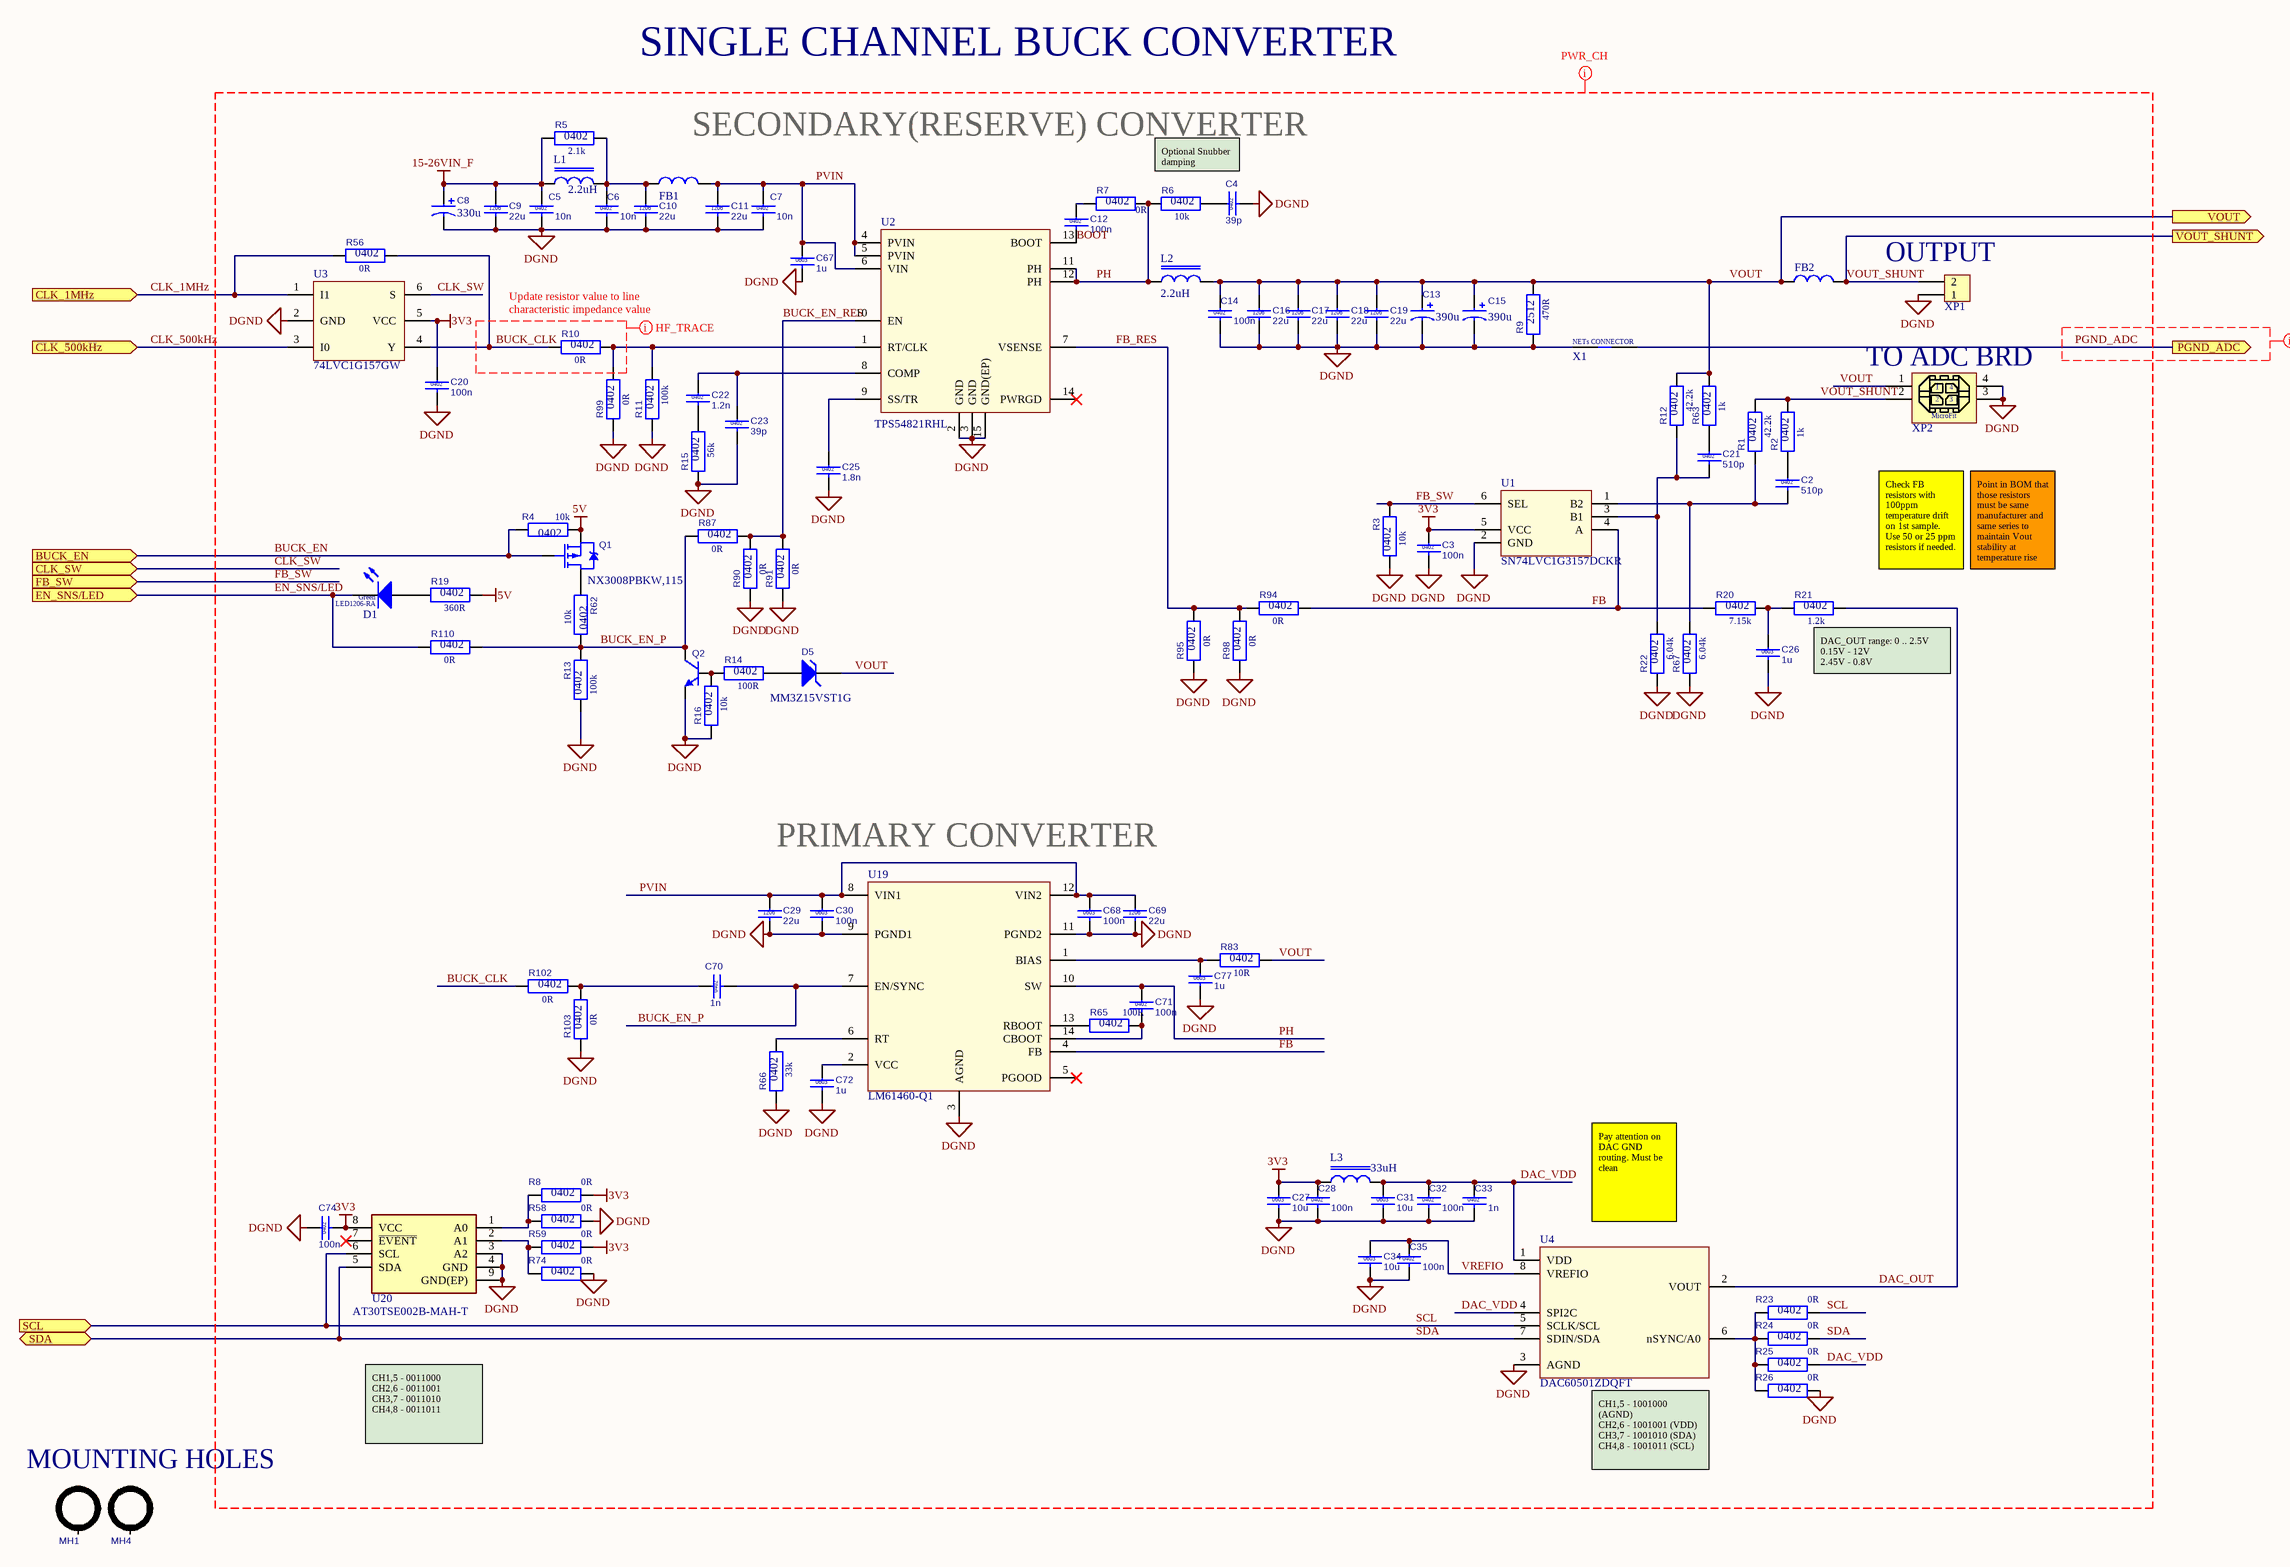
[diagram p3: BuckConverter.SchDoc]

### Parts
C2  510p  Case: 0402  [CC0402M]
C3  100n  Case: 0402  [CC0402M]
C4  39p  Case: 0402  [CC0402M]
C5  10n  Case: 0402  [CC0603M]
C6  10n  Case: 0402  [CC0603M]
C7  10n  Case: 0402  [CC0603M]
C8  330u  [CA-D10H10.5-SMD]
C9  22u  Case: 1206  [CC1206M]
C10  22u  Case: 1206  [CC1206M]
C11  22u  Case: 1206  [CC1206M]
C12  100n  Case: 0402  [CC0402M]
C13  390u  [CA-D8H12-SMD]
C14  100n  Case: 0402  [CC0402M]
C15  390u  [CA-D8H12-SMD]
C16  22u  Case: 1206  [CC1206M]
C17  22u  Case: 1206  [CC1206M]
C18  22u  Case: 1206  [CC1206M]
C19  22u  Case: 1206  [CC1206M]
C20  100n  Case: 0402  [CC0402M]
C21  510p  Case: 0402  [CC0402M]
C22  1.2n  Case: 0402  [CC0402M]
C23  39p  Case: 0402  [CC0402M]
C25  1.8n  Case: 0402  [CC0402M]
C26  1u  Case: 0603  [CC0603M]
C27  10u  Case: 0603  [CC0603M]
C28  100n  Case: 0402  [CC0402M]
C29  22u  Case: 1206  [CC1206M]
C30  100n  Case: 0603  [CC0603M]
C31  10u  Case: 0603  [CC0603M]
C32  100n  Case: 0402  [CC0402M]
C33  1n  Case: 0402  [CC0402M]
C34  10u  Case: 0603  [CC0603M]
C35  100n  Case: 0402  [CC0402M]
C67  1u  Case: 0603  [CC0603M]
C68  100n  Case: 0603  [CC0603M]
C69  22u  Case: 1206  [CC1206M]
C70  1n  Case: 0402  [CC0402M]
C71  100n  Case: 0402  [CC0402M]
C72  1u  Case: 0603  [CC0603M]
C74  100n  Case: 0402  [CC0402M]
C77  1u  Case: 0603  [CC0603M]
D1  Color: Green  [LED1206-RA]  (hidden comment: 155124GS73200A)
D5  MM3Z15VST1G  [SOD323]
FB1  BLM21SP601SH1D  [FB0805M]  (value not drawn)
FB2  BLM18KG260TN1D  [FB0603M]  (value not drawn)
L1  2.2uH  [MGV252010S]
L2  2.2uH  [104CDMCCDS]
L3  33uH  [IC0805-M]
MH1  MH-3.5-PLATED  [MH_3.5_PLATED]  (value not drawn)  (no BOM)
MH4  MH-3.5-PLATED  [MH_3.5_PLATED]  (value not drawn)  (no BOM)
Q1  NX3008PBKW,115  [SOT323]
Q2  NPN_transistor_SOT23-3  [SOT323]  (value not drawn)
R1  Case: 0402  [RC0402M]  (hidden comment: 42.2k)
R2  Case: 0402  [RC0402M]  (hidden comment: 1k)
R3  Case: 0402  [RC0402M]  (hidden comment: 10k)
R4  Case: 0402  [RC0402M]  (hidden comment: 10k)
R5  Case: 0402  [RC0402M]  (hidden comment: 2.1k)
R6  Case: 0402  [RC0402M]  (hidden comment: 10k)
R7  Case: 0402  [RC0402M]  (hidden comment: 0R)
R8  Case: 0402  [RC0402M]  (hidden comment: 0R)
R9  Case: 2512  [RC2512M]  (hidden comment: 470R)
R10  Case: 0402  [RC0402M]  (hidden comment: 0R)
R11  Case: 0402  [RC0402M]  (hidden comment: 100k)
R12  Case: 0402  [RC0402M]  (hidden comment: 42.2k)
R13  Case: 0402  [RC0402M]  (hidden comment: 100k)
R14  Case: 0402  [RC0402M]  (hidden comment: 100R)
R15  Case: 0402  [RC0402M]  (hidden comment: 56k)
R16  Case: 0402  [RC0402M]  (hidden comment: 10k)
R19  Case: 0402  [RC0402M]  (hidden comment: 360R)
R20  Case: 0402  [RC0402M]  (hidden comment: 7.15k)
R21  Case: 0402  [RC0402M]  (hidden comment: 1.2k)
R22  Case: 0402  [RC0402M]  (hidden comment: 6.04k)
R23  Case: 0402  [RC0402M]  (hidden comment: 0R)
R24  Case: 0402  [RC0402M]  (hidden comment: 0R)
R25  Case: 0402  [RC0402M]  (hidden comment: 0R)
R26  Case: 0402  [RC0402M]  (hidden comment: 0R)
R56  Case: 0402  [RC0402M]  (hidden comment: 0R)
R58  Case: 0402  [RC0402M]  (hidden comment: 0R)
R59  Case: 0402  [RC0402M]  (hidden comment: 0R)
R62  Case: 0402  [RC0402M]  (hidden comment: 10k)
R63  Case: 0402  [RC0402M]  (hidden comment: 1k)
R65  Case: 0402  [RC0402M]  (hidden comment: 100R)
R66  Case: 0402  [RC0402M]  (hidden comment: 33k)
R67  Case: 0402  [RC0402M]  (hidden comment: 6.04k)
R74  Case: 0402  [RC0402M]  (hidden comment: 0R)
R83  Case: 0402  [RC0402M]  (hidden comment: 10R)
R87  Case: 0402  [RC0402M]  (hidden comment: 0R)
R90  Case: 0402  [RC0402M]  (hidden comment: 0R)
R91  Case: 0402  [RC0402M]  (hidden comment: 0R)
R94  Case: 0402  [RC0402M]  (hidden comment: 0R)
R95  Case: 0402  [RC0402M]  (hidden comment: 0R)
R98  Case: 0402  [RC0402M]  (hidden comment: 0R)
R99  Case: 0402  [RC0402M]  (hidden comment: 0R)
R102  Case: 0402  [RC0402M]  (hidden comment: 0R)
R103  Case: 0402  [RC0402M]  (hidden comment: 0R)
R110  Case: 0402  [RC0402M]  (hidden comment: 0R)
U1  SN74LVC1G3157DCKR  [SOT363]
U2  TPS54821RHL  [VQFN-14]
U3  74LVC1G157GW  [SOT363]
U4  DAC60501ZDQFT  [WSON-8]
U19  LM61460-Q1  [VQFN-HR-14]
U20  AT30TSE002B-MAH-T  [WDFN-8]
X1  NETs_CONNECTOR  [NETs_CONNECTOR]  (value not drawn)  (no BOM)
XP1  TBH-2x3.81P-RA-GN  [TBH-2x3.81P-RA-GN]  (value not drawn)
XP2  0447690401  [0447690401]  (value not drawn)

### Ports
BUCK_EN (in), CLK_1MHz (in), CLK_500kHz (in), CLK_SW (in), EN_SNS/LED (in), FB_SW (in), PGND_ADC (out), SCL (in), SDA (bidir), VOUT (out), VOUT_SHUNT (out)

### Nets
3V3: C3.1 C20.1 C27.1 C28.1 C74.2 L3.1 R8.2 R59.2 U1.5(VCC) U3.5(VCC) U20.8(VCC)
5V: Q1.2(S) R4.2 R19.2
15-26VIN_F: C5.1 C8.1 C9.1 L1.1 R5.1
DGND: C3.2 C4.2 C5.2 C6.2 C7.2 C8.2 C9.2 C10.2 C11.2 C13.2 C14.2 C15.2 C16.2 C17.2 C18.2 C19.2 C20.2 C23.2 C25.2 C26.2 C27.2 C28.2 C29.2 C30.2 C31.2 C32.2 C33.2 C34.2 C35.2 C67.2 C68.2 C69.2 C72.2 C74.1 C77.2 Q2.2(E) R3.2 R9.1 R11.1 R13.2 R15.1 R16.1 R22.1 R26.2 R58.2 R66.1 R67.1 R74.2 R90.1 R91.1 R95.1 R98.1 R99.1 R103.1 U1.2(GND) U2.2(GND) U2.3(GND) U2.15(GND(EP)) U3.2(GND) U4.3(AGND) U19.3(AGND) U19.9(PGND1) U19.11(PGND2) U20.3(A2) U20.4(GND) U20.9(GND(EP)) X1.1 XP1.1 XP2.3 XP2.4
BOOT: C12.2 U2.13(BOOT)
BUCK_CLK: R10.1 R56.2 R102.1 U3.4(Y)
BUCK_EN: Q1.1(G) R4.1 ; port BUCK_EN
BUCK_EN_P: C70.2 Q2.3(C) R13.1 R62.2 R87.1 R110.2 U19.7(EN/SYNC)
BUCK_EN_RES: R87.2 R90.2 R91.2 U2.10(EN)
CLK_1MHz: R56.1 U3.1(I1) ; port CLK_1MHz
CLK_500kHz: U3.3(I0) ; port CLK_500kHz
CLK_SW: U3.6(S) ; port CLK_SW
DAC_OUT: R21.2 U4.2(VOUT)
DAC_VDD: C31.1 C32.1 C33.1 L3.2 R25.2 U4.1(VDD) U4.4(SPI2C)
EN_SNS/LED: D1.1(K) R110.1 ; port EN_SNS/LED
FB: R20.1 R94.2 U1.4(A) U19.4(FB)
FB_RES: R94.1 R95.2 R98.2 U2.7(VSENSE)
FB_SW: R3.1 U1.6(SEL) ; port FB_SW
PGND_ADC: X1.2 ; port PGND_ADC
PH: C71.1 L2.1 R6.1 R7.2 U2.11(PH) U2.12(PH) U19.10(SW)
PVIN: C7.1 C11.1 C29.1 C30.1 C67.1 C68.1 C69.1 FB1.2 U2.4(PVIN) U2.5(PVIN) U2.6(VIN) U19.8(VIN1) U19.12(VIN2)
SCL: R23.2 U4.5(SCLK/SCL) U20.6(SCL) ; port SCL
SDA: R24.2 U4.7(SDIN/SDA) U20.5(SDA) ; port SDA
VOUT: C13.1 C14.1 C15.1 C16.1 C17.1 C18.1 C19.1 D5.1(K) FB2.1 L2.2 R9.2 R12.2 R63.2 R83.2 XP2.1 ; port VOUT
VOUT_SHUNT: FB2.2 R1.2 R2.2 XP1.2 XP2.2 ; port VOUT_SHUNT
VREFIO: C34.1 C35.1 U4.8(VREFIO)
NetC2_1: C2.1 R2.1
NetC2_2: C2.2 R1.1 R67.2 U1.1(B2)
NetC4_1: C4.1 R6.2
NetC6_1: C6.1 C10.1 FB1.1 L1.2 R5.2
NetC12_1: C12.1 R7.1
NetC21_1: C21.1 R63.1
NetC21_2: C21.2 R12.1 R22.2 U1.3(B1)
NetC22_1: C22.1 C23.1 U2.8(COMP)
NetC22_2: C22.2 R15.2
NetC25_1: C25.1 U2.9(SS/TR)
NetC26_1: C26.1 R20.2 R21.1
NetC70_1: C70.1 R102.2 R103.2
NetC71_2: C71.2 R65.2 U19.14(CBOOT)
NetC72_1: C72.1 U19.2(VCC)
NetC77_1: C77.1 R83.1 U19.1(BIAS)
NetD1_2: D1.2(A) R19.1
NetD5_2: D5.2(A) R14.2
NetQ1_3: Q1.3(D) R62.1
NetQ2_1: Q2.1(B) R14.1 R16.2
NetR8_1: R8.1 R58.1 U20.1(A0)
NetR10_2: R10.2 R11.2 R99.2 U2.1(RT/CLK)
NetR23_1: R23.1 R24.1 R25.1 R26.1 U4.6(nSYNC/A0)
NetR59_1: R59.1 R74.1 U20.2(A1)
NetR65_1: R65.1 U19.13(RBOOT)
NetR66_2: R66.2 U19.6(RT)

Not connected (* = marked no-connect by the designer): MH1 0; MH4 0; U2 14(PWRGD)*; U19 5(PGOOD)*; U20 7(~{EVENT})*

### Channels
Designator/B1: designators end in _B1; ports BUCK_EN=BUCK_EN1 CLK_1MHz=CLK_1MHz CLK_500kHz=CLK_500kHz CLK_SW=CLK_SW1 EN_SNS/LED=EN_SNS/LED1 FB_SW=FB_SW1 PGND_ADC=PGND_ADC1 SCL=I2C0_SCL SDA=I2C0_SDA VOUT=VOUT1 VOUT_SHUNT=VOUT_SHUNT1
Designator/B2: designators end in _B2; ports BUCK_EN=BUCK_EN2 CLK_1MHz=CLK_1MHz CLK_500kHz=CLK_500kHz CLK_SW=CLK_SW2 EN_SNS/LED=EN_SNS/LED2 FB_SW=FB_SW2 PGND_ADC=PGND_ADC2 SCL=I2C0_SCL SDA=I2C0_SDA VOUT=VOUT2 VOUT_SHUNT=VOUT_SHUNT2
Designator/B3: designators end in _B3; ports BUCK_EN=BUCK_EN3 CLK_1MHz=CLK_1MHz CLK_500kHz=CLK_500kHz CLK_SW=CLK_SW3 EN_SNS/LED=EN_SNS/LED3 FB_SW=FB_SW3 PGND_ADC=PGND_ADC3 SCL=I2C0_SCL SDA=I2C0_SDA VOUT=VOUT3 VOUT_SHUNT=VOUT_SHUNT3
Designator/B4: designators end in _B4; ports BUCK_EN=BUCK_EN4 CLK_1MHz=CLK_1MHz CLK_500kHz=CLK_500kHz CLK_SW=CLK_SW4 EN_SNS/LED=EN_SNS/LED4 FB_SW=FB_SW4 PGND_ADC=PGND_ADC4 SCL=I2C0_SCL SDA=I2C0_SDA VOUT=VOUT4 VOUT_SHUNT=VOUT_SHUNT4
Designator/B5: designators end in _B5; ports BUCK_EN=BUCK_EN5 CLK_1MHz=CLK_1MHz CLK_500kHz=CLK_500kHz CLK_SW=CLK_SW5 EN_SNS/LED=EN_SNS/LED5 FB_SW=FB_SW5 PGND_ADC=PGND_ADC5 SCL=I2C1_SCL SDA=I2C1_SDA VOUT=VOUT5 VOUT_SHUNT=VOUT_SHUNT5
Designator/B6: designators end in _B6; ports BUCK_EN=BUCK_EN6 CLK_1MHz=CLK_1MHz CLK_500kHz=CLK_500kHz CLK_SW=CLK_SW6 EN_SNS/LED=EN_SNS/LED6 FB_SW=FB_SW6 PGND_ADC=PGND_ADC6 SCL=I2C1_SCL SDA=I2C1_SDA VOUT=VOUT6 VOUT_SHUNT=VOUT_SHUNT6
Designator/B7: designators end in _B7; ports BUCK_EN=BUCK_EN7 CLK_1MHz=CLK_1MHz CLK_500kHz=CLK_500kHz CLK_SW=CLK_SW7 EN_SNS/LED=EN_SNS/LED7 FB_SW=FB_SW7 PGND_ADC=PGND_ADC7 SCL=I2C1_SCL SDA=I2C1_SDA VOUT=VOUT7 VOUT_SHUNT=VOUT_SHUNT7
Designator/B8: designators end in _B8; ports BUCK_EN=BUCK_EN8 CLK_1MHz=CLK_1MHz CLK_500kHz=CLK_500kHz CLK_SW=CLK_SW8 EN_SNS/LED=EN_SNS/LED8 FB_SW=FB_SW8 PGND_ADC=PGND_ADC8 SCL=I2C1_SCL SDA=I2C1_SDA VOUT=VOUT8 VOUT_SHUNT=VOUT_SHUNT8

### Layout directives
net class PWR_CH: 3V3, 5V, 15-26VIN_F, BOOT, BUCK_CLK, BUCK_EN, BUCK_EN_P, BUCK_EN_RES, CLK_SW, DAC_OUT, DAC_VDD, DGND, EN_SNS/LED, FB, FB_RES, FB_SW, PGND_ADC, PH, PVIN, SCL, SDA, VOUT, VOUT_SHUNT, VREFIO
net class PGND_ADC: PGND_ADC
net class HF_TRACE: BUCK_CLK

### Notes on the sheet
- SINGLE CHANNEL BUCK CONVERTER
- SECONDARY(RESERVE) CONVERTER
- Optional Snubber damping
- (near XP1) OUTPUT
- (near R10) Update resistor value to line characteristic impedance value
- (near XP2) TO ADC BRD
- Check FB resistors with 100ppm temperature drift on 1st sample. Use 50 or 25 ppm resistors if needed.
- Point in BOM that those resistors must be same manufacturer and same series to maintain Vout stability at temperature rise
- (near R21) DAC_OUT range: 0 .. 2.5V
  0.15V - 12V
  2.45V - 0.8V
- PRIMARY CONVERTER
- (near U4) Pay attention on DAC GND routing. Must be clean
- CH1,5 - 0011000
  CH2,6 - 0011001
  CH3,7 - 0011010
  CH4,8 - 0011011
- MOUNTING HOLES
- (near U4) CH1,5 - 1001000 (AGND)
  CH2,6 - 1001001 (VDD)
  CH3,7 - 1001010 (SDA)
  CH4,8 - 1001011 (SCL)
- (in symbol 0447690401) MicroFit
- (in symbol NETs_CONNECTOR) NETs CONNECTOR

### Library data of the parts
C2 C21 = CC0402J-NP0-50V-510P-M: Chip ceramic capacitor; Manufacturer PN: 0402N511J500CT; Manufacturer: Walsin; Tollerance: 5%; Rated Voltage: 50V; Material: NP0; PartNumber: CC0402J-NP0-50V-510P-M; Value: 510p; Publisher: alexey.savchenko; Publishing Date: 3/16/2020
C3 C12 C14 C20 C28 C32 C35 C71 C74 = CC0402K-X7R-25V-100N-M: as C1 on sheet Control; PartNumber: CC0402K-X7R-25V-100N-M; Value: 100n; Publisher: alexey.savchenko; Publishing Date: 1/12/2020
C4 C23 = CC0402J-NP0-50V-39P-M: Chip ceramic capacitor; Manufacturer PN: CC0402JRNPO9BN390; Manufacturer: Yageo; Tollerance: 5%; Rated Voltage: 50V; Material: NP0; PartNumber: CC0402J-NP0-50V-39P-M; Value: 39p; Publisher: alexey.savchenko; Publishing Date: 2/27/2020
C5-C7 = CC0402K-X7R-50V-10N-M: as C37 on sheet Control; PartNumber: CC0402K-X7R-50V-10N-M; Value: 10n; Publisher: alexey.savchenko; Publishing Date: 2/27/2020
C8 = CE-L10D10-330U-35V-SMD: Aluminium Electrlytic capacitor; Manufacturer PN: EXV337M035A9PAA; Manufacturer: Kemet; Tollerance: 20%; Rated Voltage: 35V; ESR: 120m; Value: 330u; PartNumber: CE-L10D10-330U-35V-SMD; Publisher: alexey.savchenko; Publishing Date: 3/30/2020
C9-C11 C29 C69 = CC1206K-X5R-35V-22U-M: Chip ceramic capacitor; Manufacturer PN: C3216X5R1V226M160AC; Manufacturer: TDK; Tollerance: 10%; Rated Voltage: 35V; Material: X5R; PartNumber: CC1206K-X5R-35V-22U-M; Value: 22u; Publisher: alexey.savchenko; Publishing Date: 3/30/2020
C13 C15 = 20SVPF390M: Aluminium polymer capacitor; Manufacturer: Panasonic; Tollerance: 20%; Rated Voltage: 20V; ESR: 14m; Value: 390u; PartNumber: 20SVPF390M; Manufacturer PN: 20SVPF390M; Publisher: alexey.savchenko; Publishing Date: 1/12/2020
C16-C19 = CC1206K-X5R-25V-22U-M: Chip ceramic capacitor; Manufacturer PN: CL31A226KAHNNNE; Manufacturer: Samsung; Tollerance: 10%; Rated Voltage: 25V; Material: X5R; PartNumber: CC1206K-X5R-25V-22U-M; Value: 22u; Publisher: alexey.savchenko; Publishing Date: 1/12/2020
C22 = CC0402K-X7R-50V-1N2-M: Chip ceramic capacitor; Manufacturer PN: CC0402KRX7R9BB122; Manufacturer: Yageo; Tollerance: 10%; Rated Voltage: 50V; Material: X7R; PartNumber: CC0402K-X7R-50V-1N2-M; Value: 1.2n; Publisher: alexey.savchenko; Publishing Date: 2/27/2020
C25 = CC0402K-X7R-50V-1N8-M: Chip ceramic capacitor; Manufacturer: Yageo; Manufacturer PN: CC0402KRX7R9BB182; Tollerance: 10%; Rated Voltage: 50V; Material: X7R; PartNumber: CC0402K-X7R-50V-1N8-M; Value: 1.8n; Publisher: alexey.savchenko; Publishing Date: 2/27/2020
C26 = CC0603K-X7R-10V-1U-M: as C40 on sheet Control; PartNumber: CC0603K-X7R-10V-1U-M; Value: 1u; Publisher: alexey.savchenko; Publishing Date: 1/12/2020
C27 C31 C34 = CC0603K-X5R-10V-10U-M: as C46 on sheet Control; PartNumber: CC0603K-X5R-10V-10U-M; Value: 10u; Publisher: alexey.savchenko; Publishing Date: 1/12/2020
C30 C68 = CC0603K-X7R-50V-100N-M: Chip ceramic capacitor; Manufacturer PN: CC0603KRX7R9BB104; Manufacturer: Yageo; Tollerance: 10%; Rated Voltage: 50V; Material: X7R; PartNumber: CC0603K-X7R-50V-100N-M; Value: 100n; Publisher: alexey.savchenko; Publishing Date: 1/12/2020
C33 C70 = CC0402K-X7R-50V-1N-M: as C38 on sheet Control; PartNumber: CC0402K-X7R-50V-1N-M; Value: 1n; Publisher: alexey.savchenko; Publishing Date: 2/27/2020
C67 C72 C77 = CC0603K-X5R-50V-1U-M: Chip ceramic capacitor; Manufacturer PN: CL10A105KB8NNNC; Manufacturer: Samsung; Tollerance: 10%; Rated Voltage: 50V; Material: X5R; PartNumber: CC0603K-X5R-50V-1U-M; Value: 1u; Publisher: alexey.savchenko; Publishing Date: 1/12/2020
D1 = 155124GS73200A: LED GREEN CLEAR 1206 SMD RA; Manufacturer: Würth Elektronik; Case: LED1206-RA; PartNumber: 155124GS73200A; Manufacturer PN: 155124GS73200A; Publisher: alexey.savchenko; Publishing Date: 3/31/2020
D5 = MM3Z15VST1G: Zener Diode 14.66V 300mW ±2% Surface Mount SOD-323; Manufacturer: ON Semiconductor; PartNumber: MM3Z15VST1G; Manufacturer PN: MM3Z15VST1G; Case: SOD323; Publisher: alexey.savchenko; Publishing Date: 4/9/2020
FB1 = BLM21SP601SH1D: 600 Ohms @ 100MHz 1 Power Line Ferrite Bead 0805 (2012 Metric) 2.3A; Manufacturer: Murata; Resistance: 600; PartNumber: BLM21SP601SH1D; Manufacturer PN: BLM21SP601SH1D; Publisher: alexey.savchenko; Publishing Date: 2/17/2020
FB2 = BLM18KG260TN1D: 26 Ohms @ 100MHz 1 Power Line Ferrite Bead 0603 (1608 Metric) 6A 7mOhm; Manufacturer: Murata; Resistance: 26; PartNumber: BLM18KG260TN1D; Manufacturer PN: BLM18KG260TN1D; Publisher: alexey.savchenko; Publishing Date: 1/12/2020
L1 = MGV252010S2R2M-10: 2.2µH Shielded Molded Inductor 2.4A 110mOhm Max 1008 (2520 Metric); Manufacturer: Laird-Signal Integrity Products; Tollerance: 20%; PartNumber: MGV252010S2R2M-10; Manufacturer PN: MGV252010S2R2M-10; Value: 2.2uH; Publisher: alexey.savchenko; Publishing Date: 4/1/2020
L2 = 104CDMCCDS-2R2MC: FIXED IND 2.2UH 15A 7 MOHM; Manufacturer: Sumida; Tollerance: 20%; PartNumber: 104CDMCCDS-2R2MC; Manufacturer PN: 104CDMCCDS-2R2MC; Value: 2.2uH; Publisher: alexey.savchenko; Publishing Date: 1/12/2020
L3 = CV201210-330K: FIXED IND 33UH 5MA 1.25 OHM SMD; Manufacturer: Bourns; Tollerance: 10%; PartNumber: CV201210-330K; Manufacturer PN: CV201210-330K; Value: 33uH; Publisher: alexey.savchenko; Publishing Date: 2/17/2020
MH1 MH4 = MH-3.5-PLATED: Mounting Hole; Manufacturer PN: NULL; PartNumber: MH-3.5-PLATED; Manufacturer: NULL; Publisher: alexey.savchenko; Publishing Date: 3/25/2020
Q1 = NX3008PBKW,115: P-Channel 30V 200mA (Ta) 260mW (Ta), 830mW (Tc) Surface Mount SC-70; Manufacturer: Nexperia; PartNumber: NX3008PBKW,115; Manufacturer PN: NX3008PBKW,115; Case: SOT323; Publisher: alexey.savchenko; Publishing Date: 4/9/2020
Q2 = MMBT3904WT1G: TRANS NPN 40V 0.2A SOT323; Manufacturer: ON Semiconductor; PartNumber: MMBT3904WT1G; Manufacturer PN: MMBT3904WT1G; Case: SOT323; Publisher: alexey.savchenko; Publishing Date: 4/9/2020
R1 R12 = RC0402F-42K2-M: Chip resistor; Manufacturer PN: RC0402FR-0742K2L; Manufacturer: Yageo; Tollerance: 1%; Rated Voltage: 50V; Power: 0.063W; T Coefficient: 100ppm; Value: 42.2k; PartNumber: RC0402F-42K2-M; Publisher: alexey.savchenko; Publishing Date: 2/24/2020
R2 R63 = RC0402F-1K-M: as R30 on sheet Control; Value: 1k; PartNumber: RC0402F-1K-M; Publisher: alexey.savchenko; Publishing Date: 2/24/2020
R3 R4 R6 R16 R62 = RC0402F-10K-M: as R29 on sheet Control; Value: 10k; PartNumber: RC0402F-10K-M; Publisher: alexey.savchenko; Publishing Date: 2/24/2020
R5 = RC0402F-2K1-M: Chip resistor; Manufacturer PN: RC0402FR-072K1L; Manufacturer: Yageo; Tollerance: 1%; Rated Voltage: 50V; Power: 0.063W; T Coefficient: 100ppm; Value: 2.1k; PartNumber: RC0402F-2K1-M; Publisher: alexey.savchenko; Publishing Date: 2/24/2020
R7 R8 R10 R23-R26 R56 R58 R59 R74 R87 R90 R91 R94 R95 R98 R99 R102 R103 R110 = RC0402F-0R-M: as R68 on sheet Control; Value: 0R; PartNumber: RC0402F-0R-M; Publisher: alexey.savchenko; Publishing Date: 2/24/2020
R9 = RC2512J-479R-M: Chip resistor; Manufacturer PN: RMCF2512JT470R; Manufacturer: Stackpole; Tollerance: 5%; Rated Voltage: 200V; Power: 1W; T Coefficient: 200ppm; Value: 470R; PartNumber: RC2512J-479R-M; Publisher: alexey.savchenko; Publishing Date: 2/24/2020
R11 R13 = RC0402F-100K-M: as R36 on sheet Control; Value: 100k; PartNumber: RC0402F-100K-M; Publisher: alexey.savchenko; Publishing Date: 2/24/2020
R14 R65 = RC0402F-100R-M: as R43 on sheet Control; Value: 100R; PartNumber: RC0402F-100R-M; Publisher: alexey.savchenko; Publishing Date: 2/24/2020
R15 = RC0402F-56K-M: Chip resistor; Manufacturer PN: RC0402FR-0756KL; Manufacturer: Yageo; Tollerance: 1%; Rated Voltage: 50V; Power: 0.063W; T Coefficient: 100ppm; Value: 56k; PartNumber: RC0402F-56K-M; Publisher: alexey.savchenko; Publishing Date: 2/24/2020
R19 = RC0402F-360R-M: Chip resistor; Manufacturer PN: RC0402FR-07360RL; Manufacturer: Yageo; Tollerance: 1%; Rated Voltage: 50V; Power: 0.063W; Value: 360R; PartNumber: RC0402F-360R-M; Publisher: alexey.savchenko; Publishing Date: 2/24/2020
R20 = RC0402F-7K15-M: Chip resistor; Manufacturer PN: RC0402FR-077K15L; Manufacturer: Yageo; Tollerance: 1%; Rated Voltage: 50V; Power: 0.063W; T Coefficient: 100ppm; Value: 7.15k; PartNumber: RC0402F-7K15-M; Publisher: alexey.savchenko; Publishing Date: 2/24/2020
R21 = RC0402F-1K2-M: Chip resistor; Manufacturer PN: RC0402FR-071K2L; Manufacturer: Yageo; Tollerance: 1%; Rated Voltage: 50V; Power: 0.063W; T Coefficient: 100ppm; Value: 1.2k; PartNumber: RC0402F-1K2-M; Publisher: alexey.savchenko; Publishing Date: 2/24/2020
R22 R67 = RC0402F-6K04-M: Chip resistor; Manufacturer PN: RC0402FR-076K04L; Manufacturer: Yageo; Tollerance: 1%; Rated Voltage: 50V; Power: 0.063W; T Coefficient: 100ppm; Value: 6.04k; PartNumber: RC0402F-6K04-M; Publisher: alexey.savchenko; Publishing Date: 2/24/2020
R66 = RC0402F-33K-M: Chip resistor; Manufacturer PN: RC0402FR-0733KL; Manufacturer: Yageo; Tollerance: 1%; Rated Voltage: 50V; Power: 0.063W; T Coefficient: 100ppm; Value: 33k; PartNumber: RC0402F-33K-M; Publisher: alexey.savchenko; Publishing Date: 2/24/2020
R83 = RC0402F-10R-M: as R72 on sheet Control; Value: 10R; PartNumber: RC0402F-10R-M; Publisher: alexey.savchenko; Publishing Date: 2/24/2020
U1 = SN74LVC1G3157DCKR: 1 Circuit IC Switch 2:1 10Ohm SOT-363; Manufacturer: TI; Analogs: 74LVC1G3157DW-7(Diodes), PI5A3157CEX(Diodes); PartNumber: SN74LVC1G3157DCKR; Manufacturer PN: SN74LVC1G3157DCKR; Case: SOT363; Publisher: alexey.savchenko; Publishing Date: 4/9/2020
U2 = TPS54821RHL: IC REG BUCK ADJUSTABLE 8A 14VQFN; Manufacturer: TI; PartNumber: TPS54821RHL; Manufacturer PN: TPS54821RHL; Case: VQFN14; Publisher: alexey.savchenko; Publishing Date: 1/12/2020
U3 = 74LVC1G157GW: IC SINGLE 2-INPUT MUX 6TSSOP; Manufacturer: Nexperia; Analogs: NC7SV157P6X,NC7SZ157P6X; PartNumber: 74LVC1G157GW; Manufacturer PN: 74LVC1G157GW; Case: SOT363; Publisher: alexey.savchenko; Publishing Date: 1/21/2020
U4 = DAC60501ZDQFT: SINGLE CHAN DAC 24BIT- ZEROCODE; Manufacturer: TI; Analogs: DAC60501MDQFR, DAC60501MDQFT, DAC60501ZDQFR; PartNumber: DAC60501ZDQFT; Manufacturer PN: DAC60501ZDQFT; Case: WSON-8; Publisher: alexey.savchenko; Publishing Date: 1/13/2020
U19 = LM61460-Q1: Buck Switching Regulator IC Positive Adjustable 1V 1 Output 6A 14-VFQFN; Manufacturer PN: LM61460AASQRJRRQ1; Manufacturer: TI; PartNumber: LM61460-Q1; Case: VQFN-HR-14; Publisher: alexey.savchenko; Publishing Date: 3/27/2020
U20 = AT30TSE002B-MAH-T: Temperature Sensor Digital, Local -20°C ~ 125°C 10 b 8-WDFN (2x3); Manufacturer: Microchip; PartNumber: AT30TSE002B-MAH-T; Manufacturer PN: AT30TSE002B-MAH-T; Case: WDFN-8; Publisher: alexey.savchenko; Publishing Date: 3/31/2020
X1 = NETs_CONNECTOR: as X3 on sheet Control; PartNumber: NETs_CONNECTOR; Manufacturer: NULL; Publisher: alexey.savchenko; Publishing Date: 2/14/2020
XP1 = TBH-2x3.81P-RA-GN: 2 Position Terminal Block Header, Male Pins, Shrouded (4 Side) 0.150" (3.81mm) 90°, Right Angle Through Hole; Manufacturer PN: 691322310002+691361300002(Plug); Manufacturer: Würth Elektronik; PartNumber: TBH-2x3.81P-RA-GN; Publisher: alexey.savchenko; Publishing Date: 2/14/2020
XP2 = 0447690401: as XP3 on sheet Control; PartNumber: 0447690401; Manufacturer PN: 0447690401; Publisher: alexey.savchenko; Publishing Date: 2/14/2020

## Nets that join several sheets
3V3: Control (24 pins), Expanders (28 pins), Designator/B1 (11 pins), Designator/B2 (11 pins), Designator/B3 (11 pins), Designator/B4 (11 pins), Designator/B5 (11 pins), Designator/B6 (11 pins), Designator/B7 (11 pins), Designator/B8 (11 pins)
5V: Designator/B1 (Q1_B1.2 R4_B1.2 R19_B1.2), Designator/B2 (Q1_B2.2 R4_B2.2 R19_B2.2), Designator/B3 (Q1_B3.2 R4_B3.2 R19_B3.2), Designator/B4 (Q1_B4.2 R4_B4.2 R19_B4.2), Designator/B5 (Q1_B5.2 R4_B5.2 R19_B5.2), Designator/B6 (Q1_B6.2 R4_B6.2 R19_B6.2), Designator/B7 (Q1_B7.2 R4_B7.2 R19_B7.2), Designator/B8 (Q1_B8.2 R4_B8.2 R19_B8.2)
15-26VIN_F: Designator/B1 (5 pins), Designator/B2 (5 pins), Designator/B3 (5 pins), Designator/B4 (5 pins), Designator/B5 (5 pins), Designator/B6 (5 pins), Designator/B7 (5 pins), Designator/B8 (5 pins)
DGND: Control (28 pins), Expanders (23 pins), Designator/B1 (70 pins), Designator/B2 (70 pins), Designator/B3 (70 pins), Designator/B4 (70 pins), Designator/B5 (70 pins), Designator/B6 (70 pins), Designator/B7 (70 pins), Designator/B8 (70 pins)
BUCK_EN1: Expanders (U11.8), Designator/B1 (Q1_B1.1 R4_B1.1)
BUCK_EN2: Expanders (U11.3), Designator/B2 (Q1_B2.1 R4_B2.1)
BUCK_EN3: Expanders (U13.8), Designator/B3 (Q1_B3.1 R4_B3.1)
BUCK_EN4: Expanders (U13.3), Designator/B4 (Q1_B4.1 R4_B4.1)
BUCK_EN5: Expanders (U16.8), Designator/B5 (Q1_B5.1 R4_B5.1)
BUCK_EN6: Expanders (U16.3), Designator/B6 (Q1_B6.1 R4_B6.1)
BUCK_EN7: Expanders (U18.8), Designator/B7 (Q1_B7.1 R4_B7.1)
BUCK_EN8: Expanders (U18.3), Designator/B8 (Q1_B8.1 R4_B8.1)
CLK_1MHz: Expanders (R52.2), Designator/B1 (R56_B1.1 U3_B1.1), Designator/B2 (R56_B2.1 U3_B2.1), Designator/B3 (R56_B3.1 U3_B3.1), Designator/B4 (R56_B4.1 U3_B4.1), Designator/B5 (R56_B5.1 U3_B5.1), Designator/B6 (R56_B6.1 U3_B6.1), Designator/B7 (R56_B7.1 U3_B7.1), Designator/B8 (R56_B8.1 U3_B8.1)
CLK_500kHz: Expanders (R55.2), Designator/B1 (U3_B1.3), Designator/B2 (U3_B2.3), Designator/B3 (U3_B3.3), Designator/B4 (U3_B4.3), Designator/B5 (U3_B5.3), Designator/B6 (U3_B6.3), Designator/B7 (U3_B7.3), Designator/B8 (U3_B8.3)
CLK_EN: Control (U5.51), Expanders (R54.2 U15.1)
CLK_SW1: Expanders (U11.10), Designator/B1 (U3_B1.6)
CLK_SW2: Expanders (U11.5), Designator/B2 (U3_B2.6)
CLK_SW3: Expanders (U13.10), Designator/B3 (U3_B3.6)
CLK_SW4: Expanders (U13.5), Designator/B4 (U3_B4.6)
CLK_SW5: Expanders (U16.10), Designator/B5 (U3_B5.6)
CLK_SW6: Expanders (U16.5), Designator/B6 (U3_B6.6)
CLK_SW7: Expanders (U18.10), Designator/B7 (U3_B7.6)
CLK_SW8: Expanders (U18.5), Designator/B8 (U3_B8.6)
EN_SNS/LED1: Expanders (U11.7), Designator/B1 (D1_B1.1 R110_B1.1)
EN_SNS/LED2: Expanders (U11.2), Designator/B2 (D1_B2.1 R110_B2.1)
EN_SNS/LED3: Expanders (U13.7), Designator/B3 (D1_B3.1 R110_B3.1)
EN_SNS/LED4: Expanders (U13.2), Designator/B4 (D1_B4.1 R110_B4.1)
EN_SNS/LED5: Expanders (U16.7), Designator/B5 (D1_B5.1 R110_B5.1)
EN_SNS/LED6: Expanders (U16.2), Designator/B6 (D1_B6.1 R110_B6.1)
EN_SNS/LED7: Expanders (U18.7), Designator/B7 (D1_B7.1 R110_B7.1)
EN_SNS/LED8: Expanders (U18.2), Designator/B8 (D1_B8.1 R110_B8.1)
FB_SW1: Expanders (U11.9), Designator/B1 (R3_B1.1 U1_B1.6)
FB_SW2: Expanders (U11.4), Designator/B2 (R3_B2.1 U1_B2.6)
FB_SW3: Expanders (U13.9), Designator/B3 (R3_B3.1 U1_B3.6)
FB_SW4: Expanders (U13.4), Designator/B4 (R3_B4.1 U1_B4.6)
FB_SW5: Expanders (U16.9), Designator/B5 (R3_B5.1 U1_B5.6)
FB_SW6: Expanders (U16.4), Designator/B6 (R3_B6.1 U1_B6.6)
FB_SW7: Expanders (U18.9), Designator/B7 (R3_B7.1 U1_B7.6)
FB_SW8: Expanders (U18.4), Designator/B8 (R3_B8.1 U1_B8.6)
I2C0_SCL: Expanders (R46.1 U11.12 U12.5 U13.12), Designator/B1 (R23_B1.2 U4_B1.5 U20_B1.6), Designator/B2 (R23_B2.2 U4_B2.5 U20_B2.6), Designator/B3 (R23_B3.2 U4_B3.5 U20_B3.6), Designator/B4 (R23_B4.2 U4_B4.5 U20_B4.6)
I2C0_SDA: Expanders (R47.1 U11.13 U12.4 U13.13), Designator/B1 (R24_B1.2 U4_B1.7 U20_B1.5), Designator/B2 (R24_B2.2 U4_B2.7 U20_B2.5), Designator/B3 (R24_B3.2 U4_B3.7 U20_B3.5), Designator/B4 (R24_B4.2 U4_B4.7 U20_B4.5)
I2C1_SCL: Expanders (R48.1 U12.8 U16.12 U18.12), Designator/B5 (R23_B5.2 U4_B5.5 U20_B5.6), Designator/B6 (R23_B6.2 U4_B6.5 U20_B6.6), Designator/B7 (R23_B7.2 U4_B7.5 U20_B7.6), Designator/B8 (R23_B8.2 U4_B8.5 U20_B8.6)
I2C1_SDA: Expanders (R49.1 U12.7 U16.13 U18.13), Designator/B5 (R24_B5.2 U4_B5.7 U20_B5.5), Designator/B6 (R24_B6.2 U4_B6.7 U20_B6.5), Designator/B7 (R24_B7.2 U4_B7.7 U20_B7.5), Designator/B8 (R24_B8.2 U4_B8.7 U20_B8.5)
SCL_INT: Control (U5.1), Expanders (R50.1 U12.1)
SDA_INT: Control (U5.2), Expanders (R51.1 U12.2)

## Assembly variants
TPS54821: not fitted R69; alternate parts D4 -> SMBJ16A
LM61460-Q1: not fitted C2_B1 C2_B2 C2_B3 C2_B4 C2_B5 C2_B6 C2_B7 C2_B8 C4_B1 C4_B2 C4_B3 C4_B4 C4_B5 C4_B6 C4_B7 C4_B8 C21_B1 C21_B2 C21_B3 C21_B4 C21_B5 C21_B6 C21_B7 C21_B8 D1_B1 D1_B2 D1_B3 D1_B4 D1_B5 D1_B6 D1_B7 D1_B8 FB2_B1 FB2_B2 FB2_B3 FB2_B4 FB2_B5 FB2_B6 FB2_B7 FB2_B8 R2_B1 R2_B2 R2_B3 R2_B4 R2_B5 R2_B6 R2_B7 R2_B8 R6_B1 R6_B2 R6_B3 R6_B4 R6_B5 R6_B6 R6_B7 R6_B8 R8_B1 R8_B3 R8_B5 R8_B7 R10_B1 R10_B2 R10_B3 R10_B4 R10_B5 R10_B6 R10_B7 R10_B8 R19_B1 R19_B2 R19_B3 R19_B4 R19_B5 R19_B6 R19_B7 R19_B8 R23_B1 R23_B2 R23_B3 R23_B5 R23_B6 R23_B7 R24_B1 R24_B2 R24_B4 R24_B5 R24_B6 R24_B8 R25_B1 R25_B3 R25_B4 R25_B5 R25_B7 R25_B8 R26_B2 R26_B3 R26_B4 R26_B6 R26_B7 R26_B8 R56_B1 R56_B2 R56_B3 R56_B4 R56_B5 R56_B6 R56_B7 R56_B8 R58_B2 R58_B4 R58_B6 R58_B8 R59_B1 R59_B2 R59_B5 R59_B6 R63_B1 R63_B2 R63_B3 R63_B4 R63_B5 R63_B6 R63_B7 R63_B8 R68 R69 R74_B3 R74_B4 R74_B7 R74_B8 R87_B1 R87_B2 R87_B3 R87_B4 R87_B5 R87_B6 R87_B7 R87_B8 R94_B1 R94_B2 R94_B3 R94_B4 R94_B5 R94_B6 R94_B7 R94_B8 R103_B1 U2_B1 U2_B2 U2_B3 U2_B4 U2_B5 U2_B6 U2_B7 U2_B8 XP6